# Altium project 1000BASET1_MEDIA_CONVERTER.PrjPcb
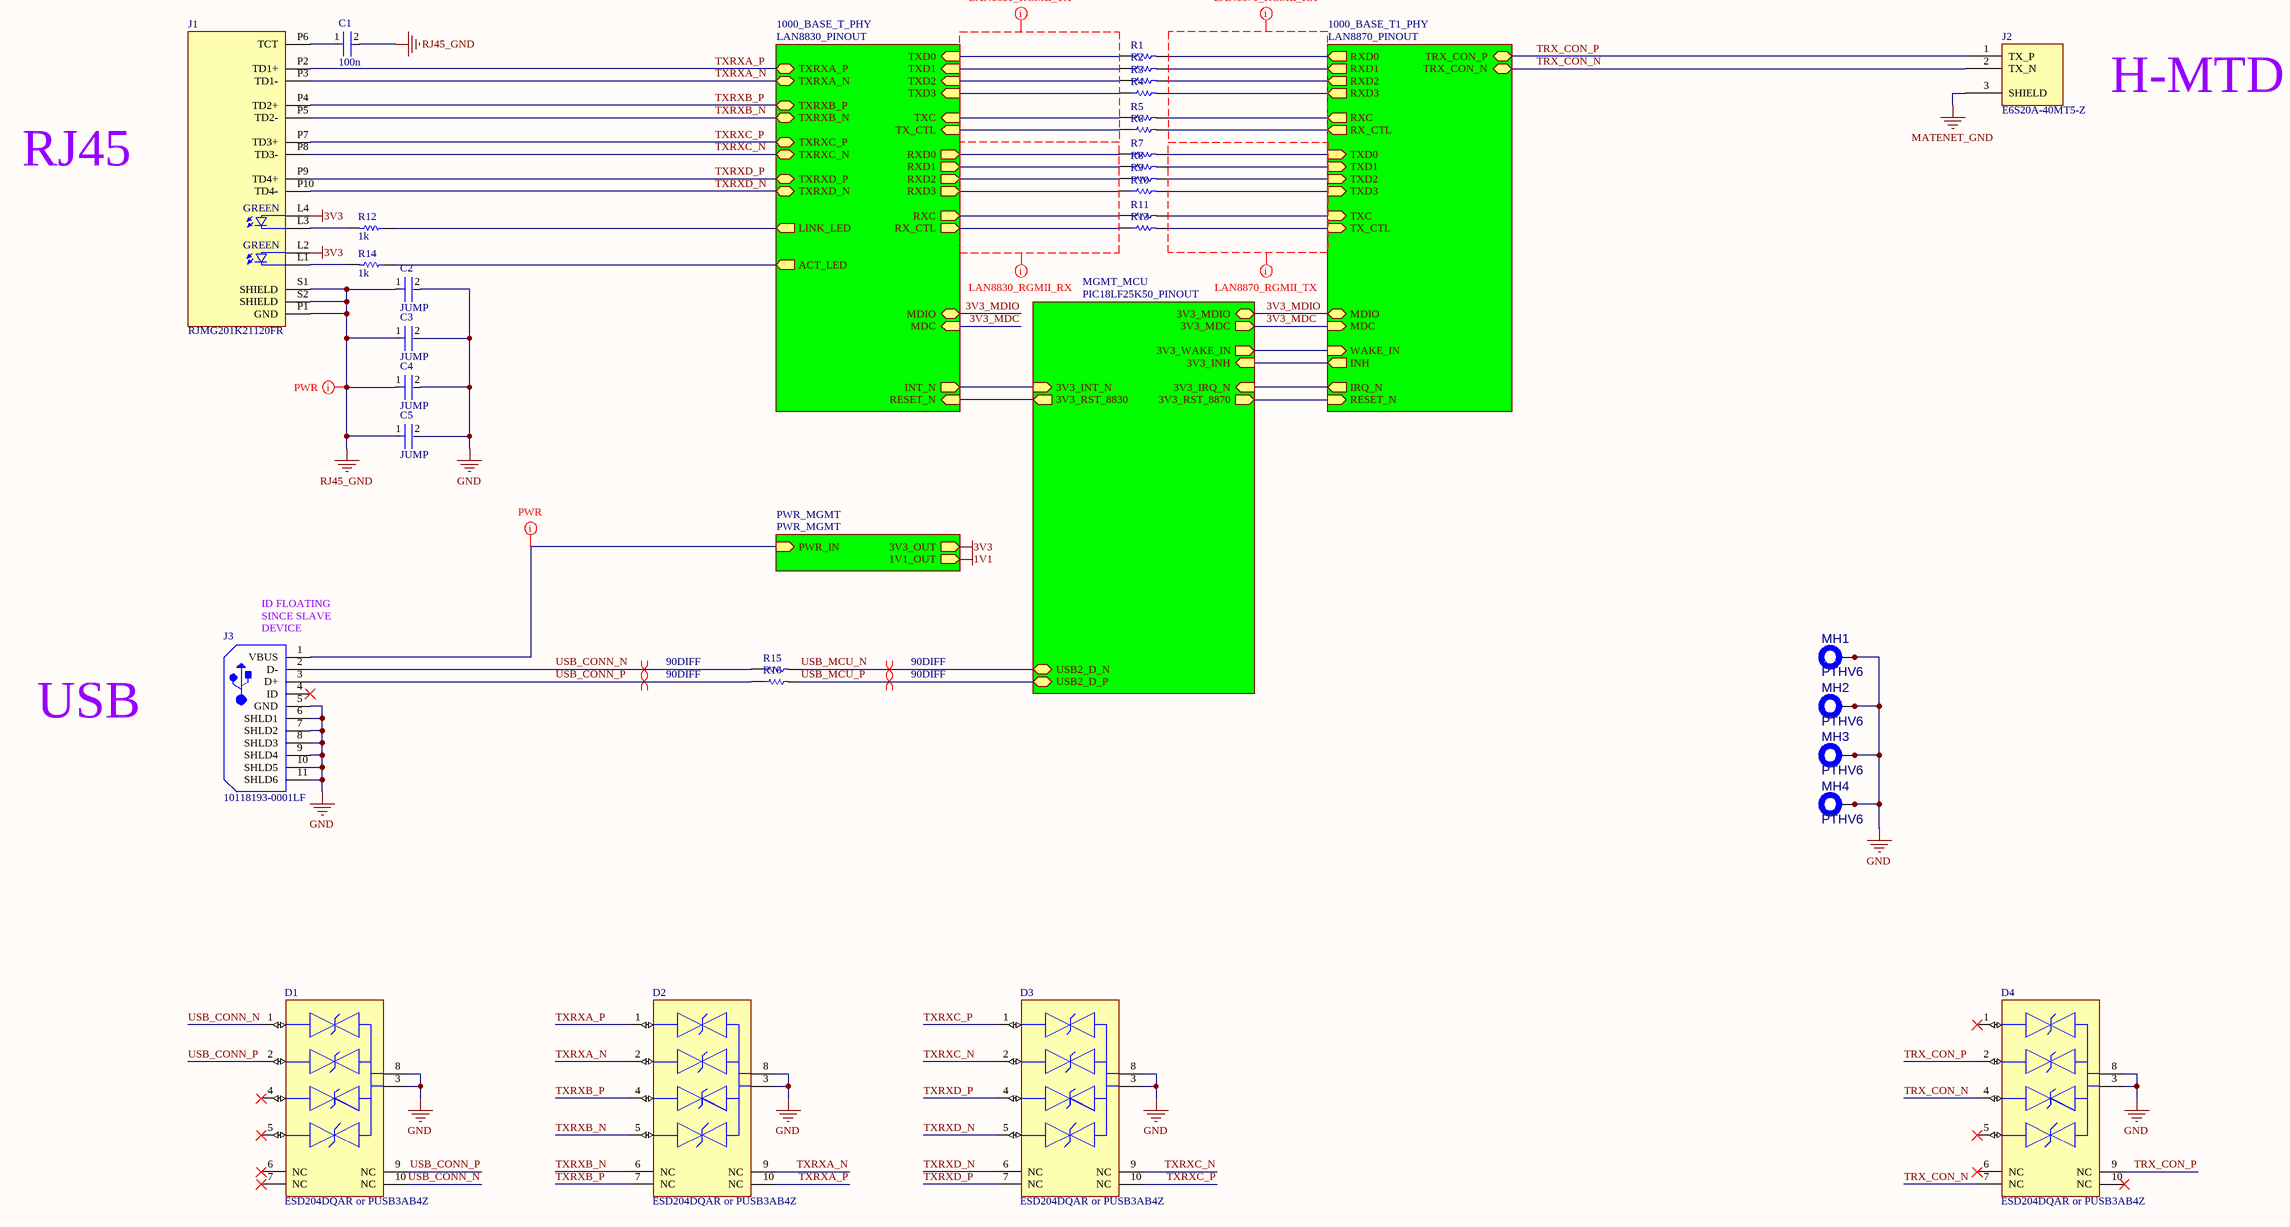
[diagram p0: 1000BASET1_MEDIA_CONVERTER.SchDoc]
5 sheets, 186 parts. Net scope: hierarchical (ports join the sheet entries above them; power ports are global).
Board file: 1000BASET1_MEDIA_CONVERTER.PcbDoc
Sheets:
  1000BASET1_MEDIA_CONVERTER.SchDoc
    1000_BASE_T_PHY = LAN8830_PINOUT.SchDoc
    1000_BASE_T1_PHY = LAN8870_PINOUT.SchDoc
    MGMT_MCU = PIC18LF25K50_PINOUT.SchDoc
    PWR_MGMT = PWR_MGMT.SchDoc

## Sheet 1000BASET1_MEDIA_CONVERTER.SchDoc
size C; SheetNumber: 1; SheetTotal: 5

### Parts
C1  100n  [FP-0402-L_1_0_0_05-W_0_5-IPC_A]
C2  JUMP  [FP-0402-L_1_0_0_05-W_0_5-IPC_A]
C3  JUMP  [FP-0402-L_1_0_0_05-W_0_5-IPC_A]
C4  JUMP  [FP-0402-L_1_0_0_05-W_0_5-IPC_A]
C5  JUMP  [FP-0402-L_1_0_0_05-W_0_5-IPC_A]
D1  ESD204DQAR or PUSB3AB4Z  [FP-DQA0010A-MFG]
D2  ESD204DQAR or PUSB3AB4Z  [FP-DQA0010A-MFG]
D3  ESD204DQAR or PUSB3AB4Z  [FP-DQA0010A-MFG]
D4  ESD204DQAR or PUSB3AB4Z  [FP-DQA0010A-MFG]
J1  RJMG201K21120FR  [RJMG201K21120FR-Footprint-1]
J2  E6S20A-40MT5-Z  [E6S20A-40MT5-Z-Footprint-1]
J3  10118193-0001LF  [FCI-10118193-0001LF-5_V]
MH1  PTHV6  [PTHV6 M2]  (net tie, no BOM)
MH2  PTHV6  [PTHV6 M2]  (net tie, no BOM)
MH3  PTHV6  [PTHV6 M2]  (net tie, no BOM)
MH4  PTHV6  [PTHV6 M2]  (net tie, no BOM)
R1  0402 JUMPER  [RESC1005X40X25ML05T05]  (value not drawn)
R2  0402 JUMPER  [RESC1005X40X25ML05T05]  (value not drawn)
R3  0402 JUMPER  [RESC1005X40X25ML05T05]  (value not drawn)
R4  0402 JUMPER  [RESC1005X40X25ML05T05]  (value not drawn)
R5  0402 JUMPER  [RESC1005X40X25ML05T05]  (value not drawn)
R6  0402 JUMPER  [RESC1005X40X25ML05T05]  (value not drawn)
R7  0402 JUMPER  [RESC1005X40X25ML05T05]  (value not drawn)
R8  0402 JUMPER  [RESC1005X40X25ML05T05]  (value not drawn)
R9  0402 JUMPER  [RESC1005X40X25ML05T05]  (value not drawn)
R10  0402 JUMPER  [RESC1005X40X25ML05T05]  (value not drawn)
R11  0402 JUMPER  [RESC1005X40X25ML05T05]  (value not drawn)
R12  1k  [R0603B]
R13  0402 JUMPER  [RESC1005X40X25ML05T05]  (value not drawn)
R14  1k  [R0603B]
R15  0402 JUMPER  [RESC1005X40X25ML05T05]  (value not drawn)
R16  0402 JUMPER  [RESC1005X40X25ML05T05]  (value not drawn)

### Sub-sheets
1000_BASE_T1_PHY = LAN8870_PINOUT: RXD0 (out), RXD1 (out), RXD2 (out), RXD3 (out), RXC (out), RX_CTL (out), TXD0 (in), TXD1 (in), TXD2 (in), TXD3 (in), TXC (in), TX_CTL (in), TRX_CON_P (bidir), TRX_CON_N (bidir), MDIO (bidir), MDC (in), IRQ_N (out), RESET_N (in), WAKE_IN (in), INH (out)
1000_BASE_T_PHY = LAN8830_PINOUT: TXD0 (in), TXD1 (in), TXD2 (in), TXD3 (in), TXC (in), TX_CTL (in), RXD0 (out), RXD1 (out), RXD2 (out), RXD3 (out), RXC (out), RX_CTL (out), TXRXA_P (bidir), TXRXA_N (bidir), TXRXB_P (bidir), TXRXB_N (bidir), TXRXC_P (bidir), TXRXC_N (bidir), TXRXD_P (bidir), TXRXD_N (bidir), ACT_LED (out), LINK_LED (out), MDIO (bidir), MDC (in), INT_N (out), RESET_N (in)
MGMT_MCU = PIC18LF25K50_PINOUT: 3V3_INH (in), 3V3_WAKE_IN (out), 3V3_RST_8870 (out), 3V3_IRQ_N (in), 3V3_RST_8830 (out), 3V3_INT_N (in), USB2_D_N (bidir), USB2_D_P (bidir), 3V3_MDC (out), 3V3_MDIO (bidir)
PWR_MGMT = PWR_MGMT: PWR_IN (in), 1V1_OUT (out), 3V3_OUT (out)

### Nets
3V3: J1.L2 J1.L4 ; sheet PWR_MGMT/3V3_OUT
GND: C2.2 C3.2 C4.2 C5.2 D1.3(GND) D1.8(GND) D2.3(GND) D2.8(GND) D3.3(GND) D3.8(GND) D4.3(GND) D4.8(GND) J3.5(GND) J3.6(SHLD1) J3.7(SHLD2) J3.8(SHLD3) J3.9(SHLD4) J3.10(SHLD5) J3.11(SHLD6) MH1.1(MH) MH1.2(V1) MH1.3(V2) MH1.4(V3) MH1.5(V4) MH1.6(V5) MH1.7(V6) MH2.1(MH) MH2.2(V1) MH2.3(V2) MH2.4(V3) MH2.5(V4) MH2.6(V5) MH2.7(V6) MH3.1(MH) MH3.2(V1) MH3.3(V2) MH3.4(V3) MH3.5(V4) MH3.6(V5) MH3.7(V6) MH4.1(MH) MH4.2(V1) MH4.3(V2) MH4.4(V3) MH4.5(V4) MH4.6(V5) MH4.7(V6)
MATENET_GND: J2.3(SHIELD)
RJ45_GND: C1.2 C2.1 C3.1 C4.1 C5.1 J1.P1(GND) J1.S1(SHIELD) J1.S2(SHIELD)
3V3_INH: sheet 1000_BASE_T1_PHY/INH, sheet MGMT_MCU/3V3_INH
3V3_INT_N: sheet 1000_BASE_T_PHY/INT_N, sheet MGMT_MCU/3V3_INT_N
3V3_IRQ_N: sheet 1000_BASE_T1_PHY/IRQ_N, sheet MGMT_MCU/3V3_IRQ_N
3V3_MDC: sheet 1000_BASE_T_PHY/MDC, sheet 1000_BASE_T1_PHY/MDC, sheet MGMT_MCU/3V3_MDC
3V3_MDIO: sheet 1000_BASE_T_PHY/MDIO, sheet 1000_BASE_T1_PHY/MDIO, sheet MGMT_MCU/3V3_MDIO
3V3_RST_8830: sheet 1000_BASE_T_PHY/RESET_N, sheet MGMT_MCU/3V3_RST_8830
3V3_RST_8870: sheet 1000_BASE_T1_PHY/RESET_N, sheet MGMT_MCU/3V3_RST_8870
3V3_WAKE_IN: sheet 1000_BASE_T1_PHY/WAKE_IN, sheet MGMT_MCU/3V3_WAKE_IN
LAN8830_CLK125_EN: R13.1 ; sheet 1000_BASE_T_PHY/RX_CTL
LAN8830_MODE0: R7.1 ; sheet 1000_BASE_T_PHY/RXD0
LAN8830_MODE1: R8.1 ; sheet 1000_BASE_T_PHY/RXD1
LAN8830_MODE2: R9.1 ; sheet 1000_BASE_T_PHY/RXD2
LAN8830_MODE3: R10.1 ; sheet 1000_BASE_T_PHY/RXD3
LAN8830_MODE4: R11.1 ; sheet 1000_BASE_T_PHY/RXC
LAN8830_PHYAD0: R14.1 ; sheet 1000_BASE_T_PHY/ACT_LED
LAN8830_PHYAD1: R12.1 ; sheet 1000_BASE_T_PHY/LINK_LED
LAN8870_RXCTL: R6.2 ; sheet 1000_BASE_T1_PHY/RX_CTL
LAN8870_RXD0: R1.2 ; sheet 1000_BASE_T1_PHY/RXD0
LAN8870_RXD1: R2.2 ; sheet 1000_BASE_T1_PHY/RXD1
LAN8870_RXD2: R3.2 ; sheet 1000_BASE_T1_PHY/RXD2
LAN8870_RXD3: R4.2 ; sheet 1000_BASE_T1_PHY/RXD3
TRX_CON_N: D4.4(IO3) D4.7(NC) J2.2(TX_N) ; sheet 1000_BASE_T1_PHY/TRX_CON_N
TRX_CON_P: D4.2(IO2) D4.9(NC) J2.1(TX_P) ; sheet 1000_BASE_T1_PHY/TRX_CON_P
TXRXA_N: D2.2(IO2) D2.9(NC) J1.P3(TD1-) ; sheet 1000_BASE_T_PHY/TXRXA_N  [project net LAN8830_TXRXA_N]
TXRXA_P: D2.1(IO1) D2.10(NC) J1.P2(TD1+) ; sheet 1000_BASE_T_PHY/TXRXA_P  [project net LAN8830_TXRXA_P]
TXRXB_N: D2.5(IO4) D2.6(NC) J1.P5(TD2-) ; sheet 1000_BASE_T_PHY/TXRXB_N  [project net LAN8830_TXRXB_N]
TXRXB_P: D2.4(IO3) D2.7(NC) J1.P4(TD2+) ; sheet 1000_BASE_T_PHY/TXRXB_P  [project net LAN8830_TXRXB_P]
TXRXC_N: D3.2(IO2) D3.9(NC) J1.P8(TD3-) ; sheet 1000_BASE_T_PHY/TXRXC_N  [project net LAN8830_TXRXC_N]
TXRXC_P: D3.1(IO1) D3.10(NC) J1.P7(TD3+) ; sheet 1000_BASE_T_PHY/TXRXC_P  [project net LAN8830_TXRXC_P]
TXRXD_N: D3.5(IO4) D3.6(NC) J1.P10(TD4-) ; sheet 1000_BASE_T_PHY/TXRXD_N  [project net LAN8830_TXRXD_N]
TXRXD_P: D3.4(IO3) D3.7(NC) J1.P9(TD4+) ; sheet 1000_BASE_T_PHY/TXRXD_P  [project net LAN8830_TXRXD_P]
USB_CONN_N: D1.1(IO1) D1.10(NC) J3.2(D-) R15.1
USB_CONN_P: D1.2(IO2) D1.9(NC) J3.3(D+) R16.1
USB_MCU_N: R15.2 ; sheet MGMT_MCU/USB2_D_N
USB_MCU_P: R16.2 ; sheet MGMT_MCU/USB2_D_P
NetC1_1: C1.1 J1.P6(TCT)
NetF1_1: J3.1(VBUS) ; sheet PWR_MGMT/PWR_IN
NetJ1_L1: J1.L1 R14.2
NetJ1_L3: J1.L3 R12.2
NetR1_1: R1.1 ; sheet 1000_BASE_T_PHY/TXD0
NetR2_1: R2.1 ; sheet 1000_BASE_T_PHY/TXD1
NetR3_1: R3.1 ; sheet 1000_BASE_T_PHY/TXD2
NetR4_1: R4.1 ; sheet 1000_BASE_T_PHY/TXD3
NetR5_1: R5.1 ; sheet 1000_BASE_T_PHY/TXC
NetR5_2: R5.2 ; sheet 1000_BASE_T1_PHY/RXC
NetR6_1: R6.1 ; sheet 1000_BASE_T_PHY/TX_CTL
NetR7_2: R7.2 ; sheet 1000_BASE_T1_PHY/TXD0
NetR8_2: R8.2 ; sheet 1000_BASE_T1_PHY/TXD1
NetR9_2: R9.2 ; sheet 1000_BASE_T1_PHY/TXD2
NetR10_2: R10.2 ; sheet 1000_BASE_T1_PHY/TXD3
NetR11_2: R11.2 ; sheet 1000_BASE_T1_PHY/TXC
NetR13_2: R13.2 ; sheet 1000_BASE_T1_PHY/TX_CTL

Not connected (* = marked no-connect by the designer): D1 4(IO3)* 5(IO4)* 6(NC)* 7(NC)*; D4 1(IO1)* 5(IO4)* 6(NC)* 10(NC)*; J3 4(ID)*

### Layout directives
differential pair; differential pair class 90DIFF: USB_CONN_N, USB_CONN_P, USB_MCU_N, USB_MCU_P
net class LAN8830_RGMII_TX: (no net found under the mark)
net class LAN8870_RGMII_RX: (no net found under the mark)
net class LAN8870_RGMII_TX: (no net found under the mark)
net class LAN8830_RGMII_RX: (no net found under the mark)
net class PWR: NetF1_1, RJ45_GND

### Notes on the sheet
- H-MTD
- RJ45
- (near J3) ID FLOATING SINCE SLAVE DEVICE
- USB
- (in symbol CMP-002-00090-1) GREEN

### Library data of the parts
C1-C5 = CMP-001-00058-1: LARGE PADS, 0402 CAP, CHANGE COMMENT TO MATCH REAL P/N; Capacitor Type: Ceramic; Min Operating Temperature: -55°C; Mounting Technology: Surface Mount; Pins: 2; Case/Package: 0402; RoHS Compliant: Yes; Max Operating Temperature: 85°C
D1-D4 = CMP-04989-000002-1: 4-CHANNEL LOW-CAPACITANCE SURGE; Manufacturer: Texas Instruments; Value: 0.55pF; Reverse Standoff Voltage: 3.6V; Standoff Height: 0mm; Breakdown Voltage: 5.5V; Peak Pulse Current: 5.5A; Clamping Voltage: 11.5V; Direction: Bidirectional; Peak Pulse Power: 50W; Number Of Channels: 4; Ambient Temperature Range High: +125°C; ComponentLink2Description: Datasheet; Height: 0.55mm; Lead Free: Yes; Device Class L3: unset; Temperature Range High: +125°C; Temperature Range Low: -40°C; Package: DQA0010A; Temperature: -40°C to +125°C; Capacitance: 0.55pF; RoHS: TRUE; Mouser Description: 4-Channel Low-Capacitance Surge and ESD Protection Diode 10-USON -40 to 125; Category: Diode; Device Class L1: Circuit Protection; Octopart: https://octopart.com/esd204dqar-texas+instruments-89917476; Device Class L2: TVS Diodes; Ambient Temperature Range Low: -40°C; Manufacturer Part Number: ESD204DQAR; ComponentLink2URL: http://www.ti.com/lit/ds/symlink/esd204.pdf; Automotive: No; Digikey Description: 4-CHANNEL LOW-CAPACITANCE SURGE
J1 = CMP-002-00090-1: Connector RJ45 Receptacle 8 Position Solder Straight Through Hole 1 Port Tray; Pins: 8; Max Operating Temperature: 70°C; Min Operating Temperature: 0°C
J2 = CMP-002-00103-1: RF Connector, 2 Contact(s), Male, Panel Mount, Board And Panel Mount, Solder Terminal, Plug; Pins: 2; Min Operating Temperature: -40°C; Max Operating Temperature: 105°C
J3 = CMP-2000-05119-1: Micro USB B Type Receptacle, -55 to 85 degC, 5-Pin SMD, RoHS, Tape and Reel; Manufacturer: FCI; Insulation Resistance: 1000MOhms; Gender: Female; Current Rating: 1.8A; Number of Contacts: 5Contact; Connector Type: MicroUSBTypeBreceptacle; Mounting Angle: Right; Datasheet Version: Rev. C, 05/2015; Packaging: Reel; Product Category: USBConnectors; Standard: USB2.0; Factory Pack Quantity: 1200; Operating Temperature Range: -55Cto+85C; Termination Style: SMD/SMT; Datasheet URL: http://datasheet.octopart.com/10118193-0001LF-FCI-datasheet-55953155.pdf; Contact Material: CopperAlloy; RoHS: Details; Contact Plating: Gold; Flammability Rating: UL94V-0; Manufacturer URL: http://www.fci.com/; Brand: FCI; Product: MicroUSBTypeBConnectors; Color: Black
MH1-MH4 = CMP-00028-00001-13: Plated mounting hole with 6 peripheral vias. This is a generic symbol that groups all relevant footprints.
R1-R11 R13 R15 R16 = CMP-009-00118-2: READ THE NAME; Pins: 2; Component Type: Standard; Design Item ID: CMP-009-00206-2; Source: 0402jump.SchLib
R12 R14 = CMP-009-00002-14: Resistor; Value: 1k

## Sheet LAN8830_PINOUT.SchDoc
size C; SheetNumber: 2; SheetTotal: 5
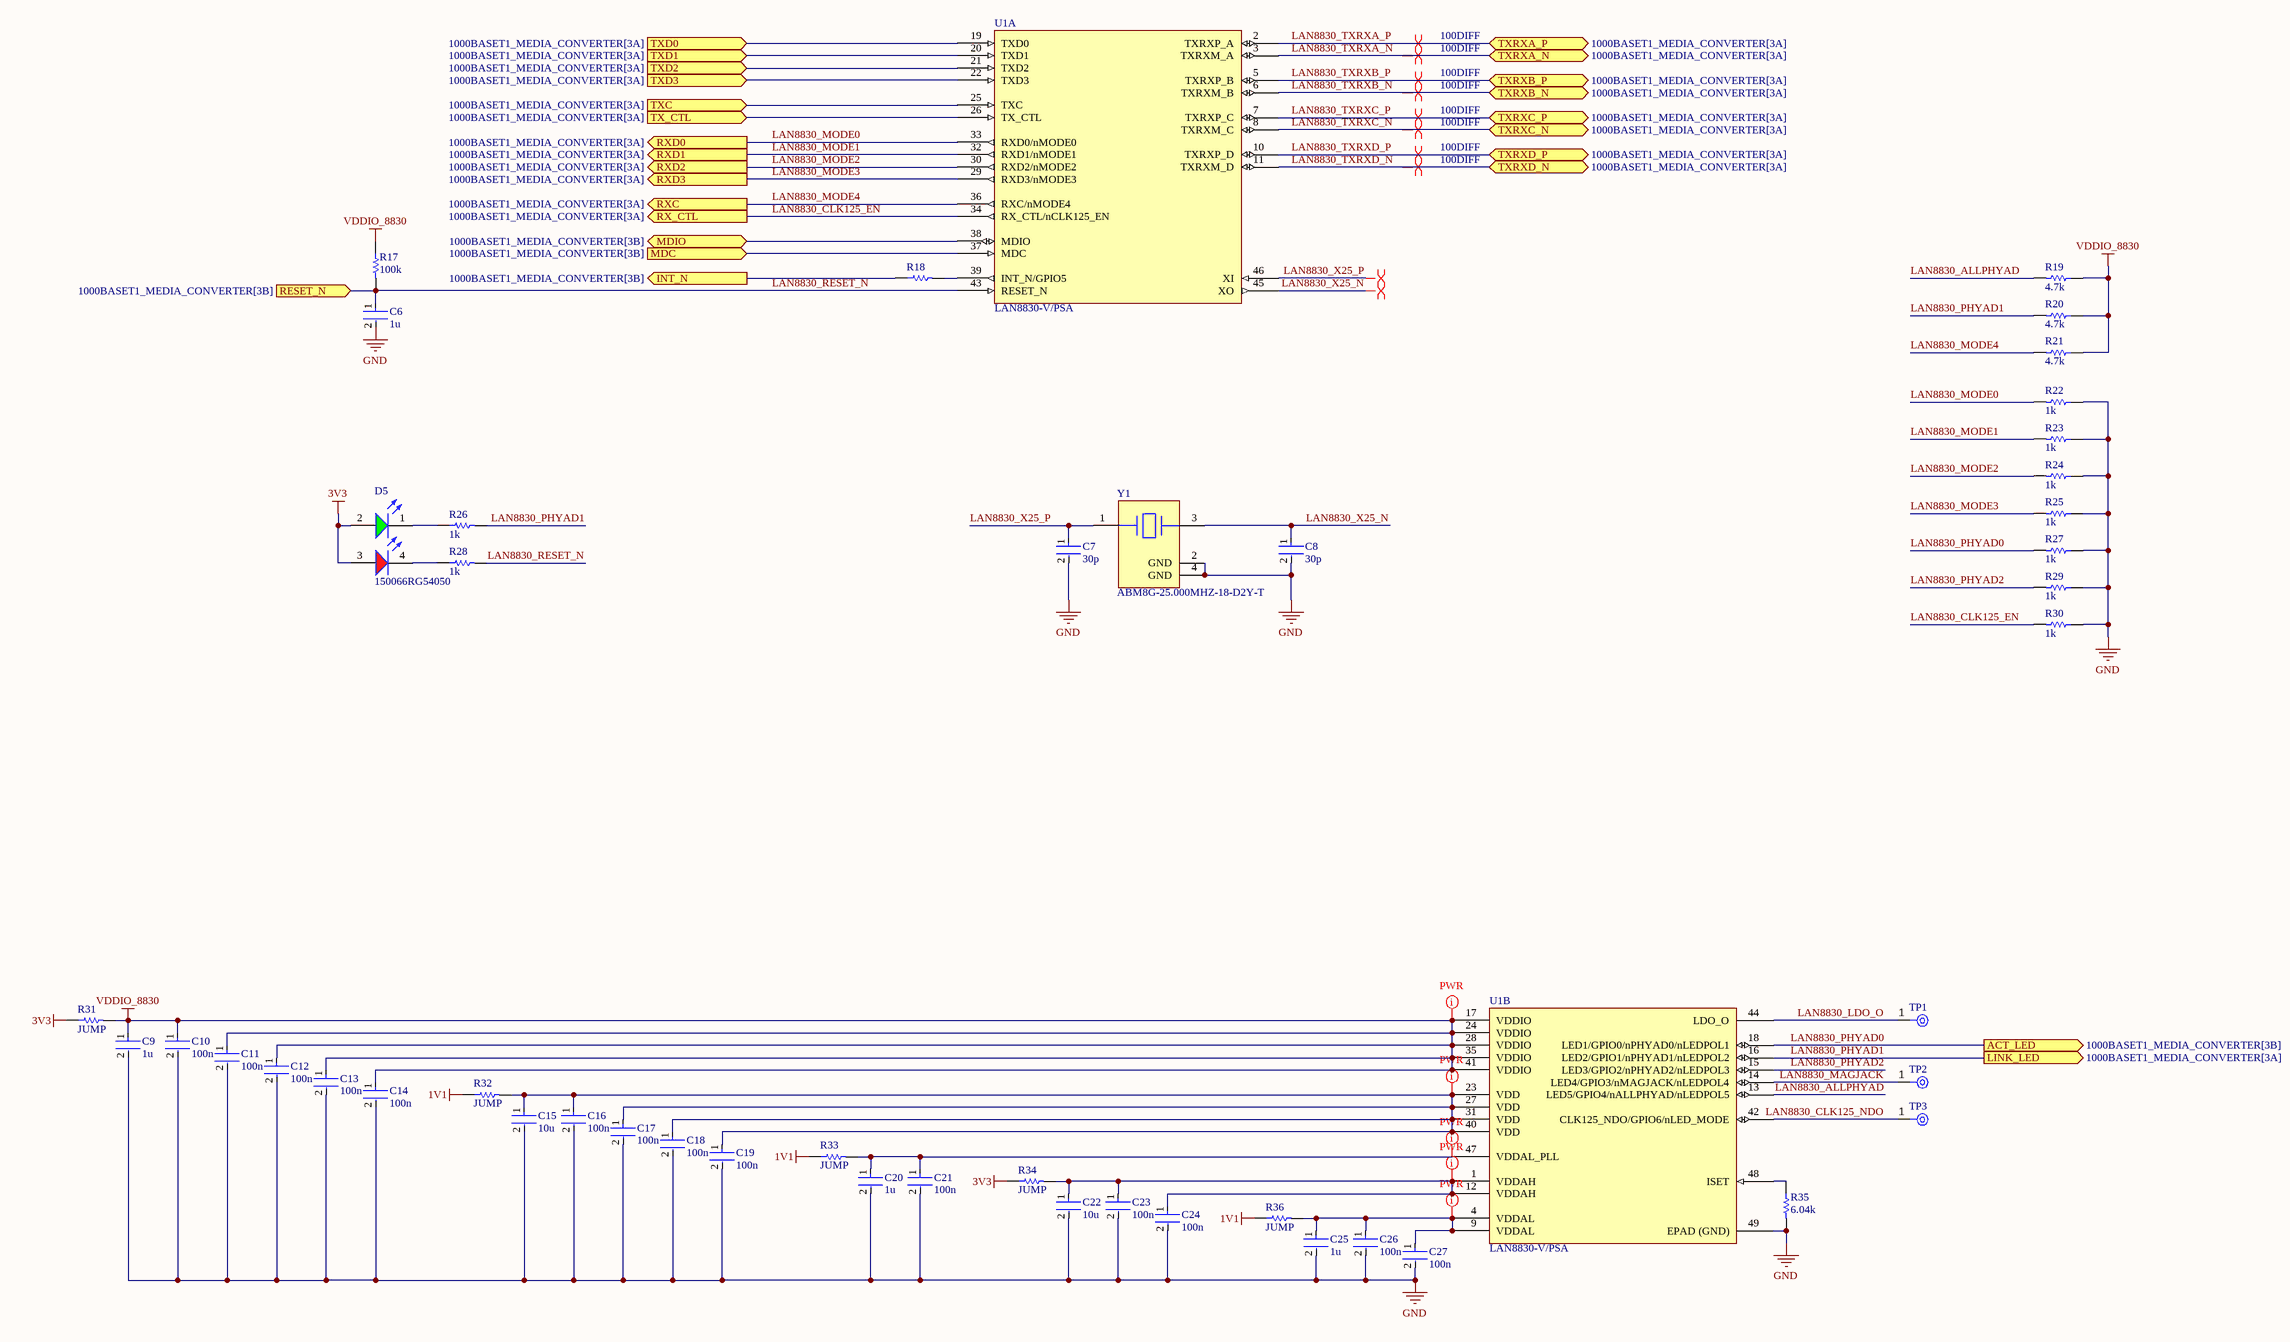
[diagram p1: LAN8830_PINOUT.SchDoc]

### Parts
C6  1u  [FP-0402-L_1_0_0_05-W_0_5-IPC_A]
C7  30p  [FP-0402-L_1_0_0_05-W_0_5-IPC_A]
C8  30p  [FP-0402-L_1_0_0_05-W_0_5-IPC_A]
C9  1u  [FP-0402-L_1_0_0_05-W_0_5-IPC_A]
C10  100n  [FP-0402-L_1_0_0_05-W_0_5-IPC_A]
C11  100n  [FP-0402-L_1_0_0_05-W_0_5-IPC_A]
C12  100n  [FP-0402-L_1_0_0_05-W_0_5-IPC_A]
C13  100n  [FP-0402-L_1_0_0_05-W_0_5-IPC_A]
C14  100n  [FP-0402-L_1_0_0_05-W_0_5-IPC_A]
C15  10u  [FP-0402-L_1_0_0_05-W_0_5-IPC_A]
C16  100n  [FP-0402-L_1_0_0_05-W_0_5-IPC_A]
C17  100n  [FP-0402-L_1_0_0_05-W_0_5-IPC_A]
C18  100n  [FP-0402-L_1_0_0_05-W_0_5-IPC_A]
C19  100n  [FP-0402-L_1_0_0_05-W_0_5-IPC_A]
C20  1u  [FP-0402-L_1_0_0_05-W_0_5-IPC_A]
C21  100n  [FP-0402-L_1_0_0_05-W_0_5-IPC_A]
C22  10u  [FP-0402-L_1_0_0_05-W_0_5-IPC_A]
C23  100n  [FP-0402-L_1_0_0_05-W_0_5-IPC_A]
C24  100n  [FP-0402-L_1_0_0_05-W_0_5-IPC_A]
C25  1u  [FP-0402-L_1_0_0_05-W_0_5-IPC_A]
C26  100n  [FP-0402-L_1_0_0_05-W_0_5-IPC_A]
C27  100n  [FP-0402-L_1_0_0_05-W_0_5-IPC_A]
D5  150066RG54050  [WL-SBCD_0606]
R17  100k  [R0603B]
R18  0402 JUMPER  [RESC1005X40X25ML05T05]  (value not drawn)
R19  4.7k  [R0603B]
R20  4.7k  [R0603B]
R21  4.7k  [R0603B]
R22  1k  [R0603B]
R23  1k  [R0603B]
R24  1k  [R0603B]
R25  1k  [R0603B]
R26  1k  [R0603B]
R27  1k  [R0603B]
R28  1k  [R0603B]
R29  1k  [R0603B]
R30  1k  [R0603B]
R31  JUMP  [R0603B]
R32  JUMP  [R0603B]
R33  JUMP  [R0603B]
R34  JUMP  [R0603B]
R35  6.04k  [R0603B]
R36  JUMP  [R0603B]
TP1  TPAD6R  [New footprint 1]  (value not drawn)  (no BOM)
TP2  TPAD6R  [New footprint 1]  (value not drawn)  (no BOM)
TP3  TPAD6R  [New footprint 1]  (value not drawn)  (no BOM)
U1  LAN8830-V/PSA  [QFN50P700X700X100_HS-49N]  (parts A,B of 2)
Y1  ABM8G-25.000MHZ-18-D2Y-T  [FP-ABM8G-MFG]

### Ports
ACT_LED (out, see 1000BASET1_MEDIA_CONVERTER[3B]), INT_N (out, see 1000BASET1_MEDIA_CONVERTER[3B]), LINK_LED (out, see 1000BASET1_MEDIA_CONVERTER[3A]), MDC (in, see 1000BASET1_MEDIA_CONVERTER[3B]), MDIO (bidir, see 1000BASET1_MEDIA_CONVERTER[3B]), RESET_N (in, see 1000BASET1_MEDIA_CONVERTER[3B]), RX_CTL (out, see 1000BASET1_MEDIA_CONVERTER[3A]), RXC (out, see 1000BASET1_MEDIA_CONVERTER[3A]), RXD0 (out, see 1000BASET1_MEDIA_CONVERTER[3A]), RXD1 (out, see 1000BASET1_MEDIA_CONVERTER[3A]), RXD2 (out, see 1000BASET1_MEDIA_CONVERTER[3A]), RXD3 (out, see 1000BASET1_MEDIA_CONVERTER[3A]), TX_CTL (in, see 1000BASET1_MEDIA_CONVERTER[3A]), TXC (in, see 1000BASET1_MEDIA_CONVERTER[3A]), TXD0 (in, see 1000BASET1_MEDIA_CONVERTER[3A]), TXD1 (in, see 1000BASET1_MEDIA_CONVERTER[3A]), TXD2 (in, see 1000BASET1_MEDIA_CONVERTER[3A]), TXD3 (in, see 1000BASET1_MEDIA_CONVERTER[3A]), TXRXA_N (bidir, see 1000BASET1_MEDIA_CONVERTER[3A]), TXRXA_P (bidir, see 1000BASET1_MEDIA_CONVERTER[3A]), TXRXB_N (bidir, see 1000BASET1_MEDIA_CONVERTER[3A]), TXRXB_P (bidir, see 1000BASET1_MEDIA_CONVERTER[3A]), TXRXC_N (bidir, see 1000BASET1_MEDIA_CONVERTER[3A]), TXRXC_P (bidir, see 1000BASET1_MEDIA_CONVERTER[3A]), TXRXD_N (bidir, see 1000BASET1_MEDIA_CONVERTER[3A]), TXRXD_P (bidir, see 1000BASET1_MEDIA_CONVERTER[3A])

### Nets
1V1: R32.1 R33.1 R36.1
3V3: D5.2(A) D5.3(A) R31.1 R34.1
GND: C6.2 C7.2 C8.2 C9.2 C10.2 C11.2 C12.2 C13.2 C14.2 C15.2 C16.2 C17.2 C18.2 C19.2 C20.2 C21.2 C22.2 C23.2 C24.2 C25.2 C26.2 C27.2 R22.1 R23.1 R24.1 R25.1 R27.1 R29.1 R30.1 R35.2 U1.49(EPAD_(GND)) Y1.2(GND) Y1.4(GND)
VDDIO_8830: C9.1 C10.1 C11.1 C12.1 C13.1 C14.1 R17.1 R19.1 R20.1 R21.1 R31.2 U1.17(VDDIO) U1.24(VDDIO) U1.28(VDDIO) U1.35(VDDIO) U1.41(VDDIO)
3V3_INT_N: R18.1 ; port INT_N
3V3_MDC: U1.37(MDC) ; port MDC
3V3_MDIO: U1.38(MDIO) ; port MDIO
LAN8830_ALLPHYAD: R19.2 U1.13(LED5/GPIO4/nALLPHYAD/nLEDPOL5)
LAN8830_CLK125_EN: R30.2 U1.34(RX_CTL/nCLK125_EN) ; port RX_CTL
LAN8830_CLK125_NDO: TP3.1(TP) U1.42(CLK125_NDO/GPIO6/nLED_MODE)
LAN8830_LDO_O: TP1.1(TP) U1.44(LDO_O)
LAN8830_MAGJACK: TP2.1(TP) U1.14(LED4/GPIO3/nMAGJACK/nLEDPOL4)
LAN8830_MODE0: R22.2 U1.33(RXD0/nMODE0) ; port RXD0
LAN8830_MODE1: R23.2 U1.32(RXD1/nMODE1) ; port RXD1
LAN8830_MODE2: R24.2 U1.30(RXD2/nMODE2) ; port RXD2
LAN8830_MODE3: R25.2 U1.29(RXD3/nMODE3) ; port RXD3
LAN8830_MODE4: R21.2 U1.36(RXC/nMODE4) ; port RXC
LAN8830_PHYAD0: R27.2 U1.18(LED1/GPIO0/nPHYAD0/nLEDPOL1) ; port ACT_LED
LAN8830_PHYAD1: R20.2 R26.2 U1.16(LED2/GPIO1/nPHYAD1/nLEDPOL2) ; port LINK_LED
LAN8830_PHYAD2: R29.2 U1.15(LED3/GPIO2/nPHYAD2/nLEDPOL3)
LAN8830_RESET_N: C6.1 R17.2 R28.2 U1.43(RESET_N) ; port RESET_N  [project net 3V3_RST_8830]
LAN8830_TXRXA_N: U1.3(TXRXM_A) ; port TXRXA_N
LAN8830_TXRXA_P: U1.2(TXRXP_A) ; port TXRXA_P
LAN8830_TXRXB_N: U1.6(TXRXM_B) ; port TXRXB_N
LAN8830_TXRXB_P: U1.5(TXRXP_B) ; port TXRXB_P
LAN8830_TXRXC_N: U1.8(TXRXM_C) ; port TXRXC_N
LAN8830_TXRXC_P: U1.7(TXRXP_C) ; port TXRXC_P
LAN8830_TXRXD_N: U1.11(TXRXM_D) ; port TXRXD_N
LAN8830_TXRXD_P: U1.10(TXRXP_D) ; port TXRXD_P
LAN8830_X25_N: C8.1 U1.45(XO) Y1.3
LAN8830_X25_P: C7.1 U1.46(XI) Y1.1
NetC15_1: C15.1 C16.1 C17.1 C18.1 C19.1 R32.2 U1.23(VDD) U1.27(VDD) U1.31(VDD) U1.40(VDD)
NetC20_1: C20.1 C21.1 R33.2 U1.47(VDDAL_PLL)
NetC22_1: C22.1 C23.1 C24.1 R34.2 U1.1(VDDAH) U1.12(VDDAH)
NetC25_1: C25.1 C26.1 C27.1 R36.2 U1.4(VDDAL) U1.9(VDDAL)
NetD5_1: D5.1(K) R26.1
NetD5_4: D5.4(K) R28.1
NetR1_1: U1.19(TXD0) ; port TXD0
NetR2_1: U1.20(TXD1) ; port TXD1
NetR3_1: U1.21(TXD2) ; port TXD2
NetR4_1: U1.22(TXD3) ; port TXD3
NetR5_1: U1.25(TXC) ; port TXC
NetR6_1: U1.26(TX_CTL) ; port TX_CTL
NetR18_2: R18.2 U1.39(INT_N/GPIO5)
NetR35_1: R35.1 U1.48(ISET)

### Layout directives
differential pair; differential pair class 100DIFF: LAN8830_TXRXA_N, LAN8830_TXRXA_P, LAN8830_TXRXB_N, LAN8830_TXRXB_P, LAN8830_TXRXC_N, LAN8830_TXRXC_P, LAN8830_TXRXD_N, LAN8830_TXRXD_P
differential pair: LAN8830_X25_N, LAN8830_X25_P
net class PWR: NetC15_1, NetC20_1, NetC22_1, NetC25_1, VDDIO_8830

### Library data of the parts
C6-C27 = CMP-001-00058-1: as C1 on sheet 1000BASET1_MEDIA_CONVERTER; Min Operating Temperature: -55°C; Mounting Technology: Surface Mount; Pins: 2; Case/Package: 0402; RoHS Compliant: Yes; Max Operating Temperature: 85°C
D5 = CMP-004-00040-2: Led, Red/Grn, 180Mcd/230Mcd, 624Nm/525Nm Rohs Compliant: Yes; Source: rgled.SchLib; Component Type: Standard; Design Item ID: CMP-004-00034-2; Pins: 4
R17 R19-R30 R35 = CMP-009-00002-14: Resistor
  R17: Value: 100k
  R19-R21: Value: 4.7k
  R22-R30: Value: 1k
  R35: Value: 6.04k
R18 = CMP-009-00118-2: READ THE NAME; Pins: 2; Component Type: Standard; Design Item ID: CMP-009-00206-2; Source: 0402jump.SchLib
R31-R34 R36 = CMP-009-00002-14: Resistor; Value: 0
TP1-TP3 = CMP-00025-3: Test Point .6mm
U1 = CMP-015-00022-4: LAN8830 Series RGMII Interface Gigabit Ethernet Transceiver - VQFN-48; Case/Package: VQFN; Pins: 48
Y1 = CMP-2000-05733-3: Crystal 25MHz ±20ppm (Tol) ±30ppm (Stability) 18pF FUND 60Ω 4-Pin SMD T/R; Series Resistance: 60R; Length: 3.2mm; Depth: 2.5mm; Packaging: Tape and Reel; Min Operating Temperature: -40°C; Operating Frequency: 25 MHz; Lead Free: Lead Free; Number of Pins: 4; Frequency Tolerance: 20ppm; Radiation Hardening: No; Max Operating Temperature: 85°C; Termination: SMD/SMT; Frequency Stability: 30ppm; Frequency: 25MHz; Series: ABM8G; Mount: Surface Mount; Package Quantity: 1000; Height: 0.039inch; Width: 0.098inch; Case/Package: CSMD; ESR (Equivalent Series Resistance): 60R; Load Capacitance: 18pF; Tolerance: 20ppm

## Sheet LAN8870_PINOUT.SchDoc
size C; SheetNumber: 3; SheetTotal: 5
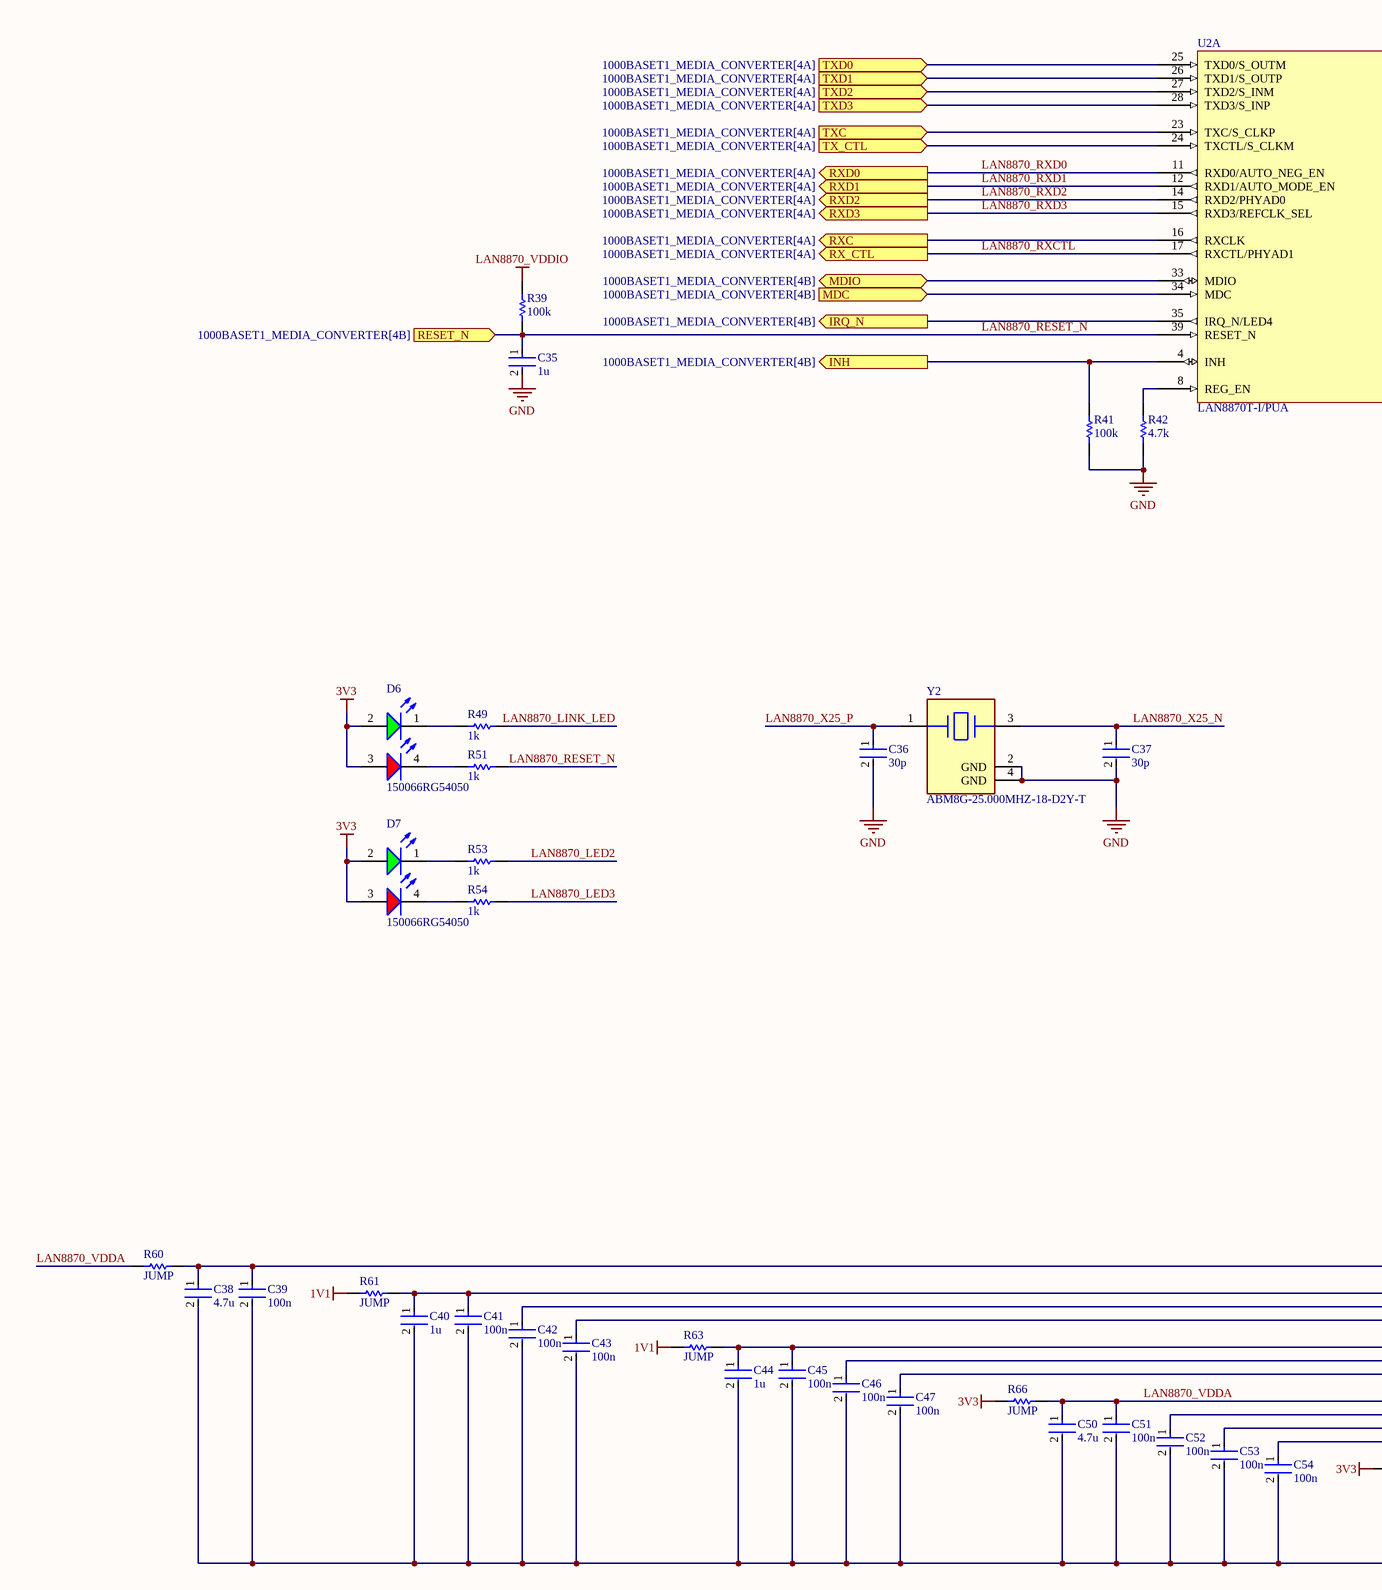
[diagram p2: LAN8870_PINOUT.SchDoc, left]
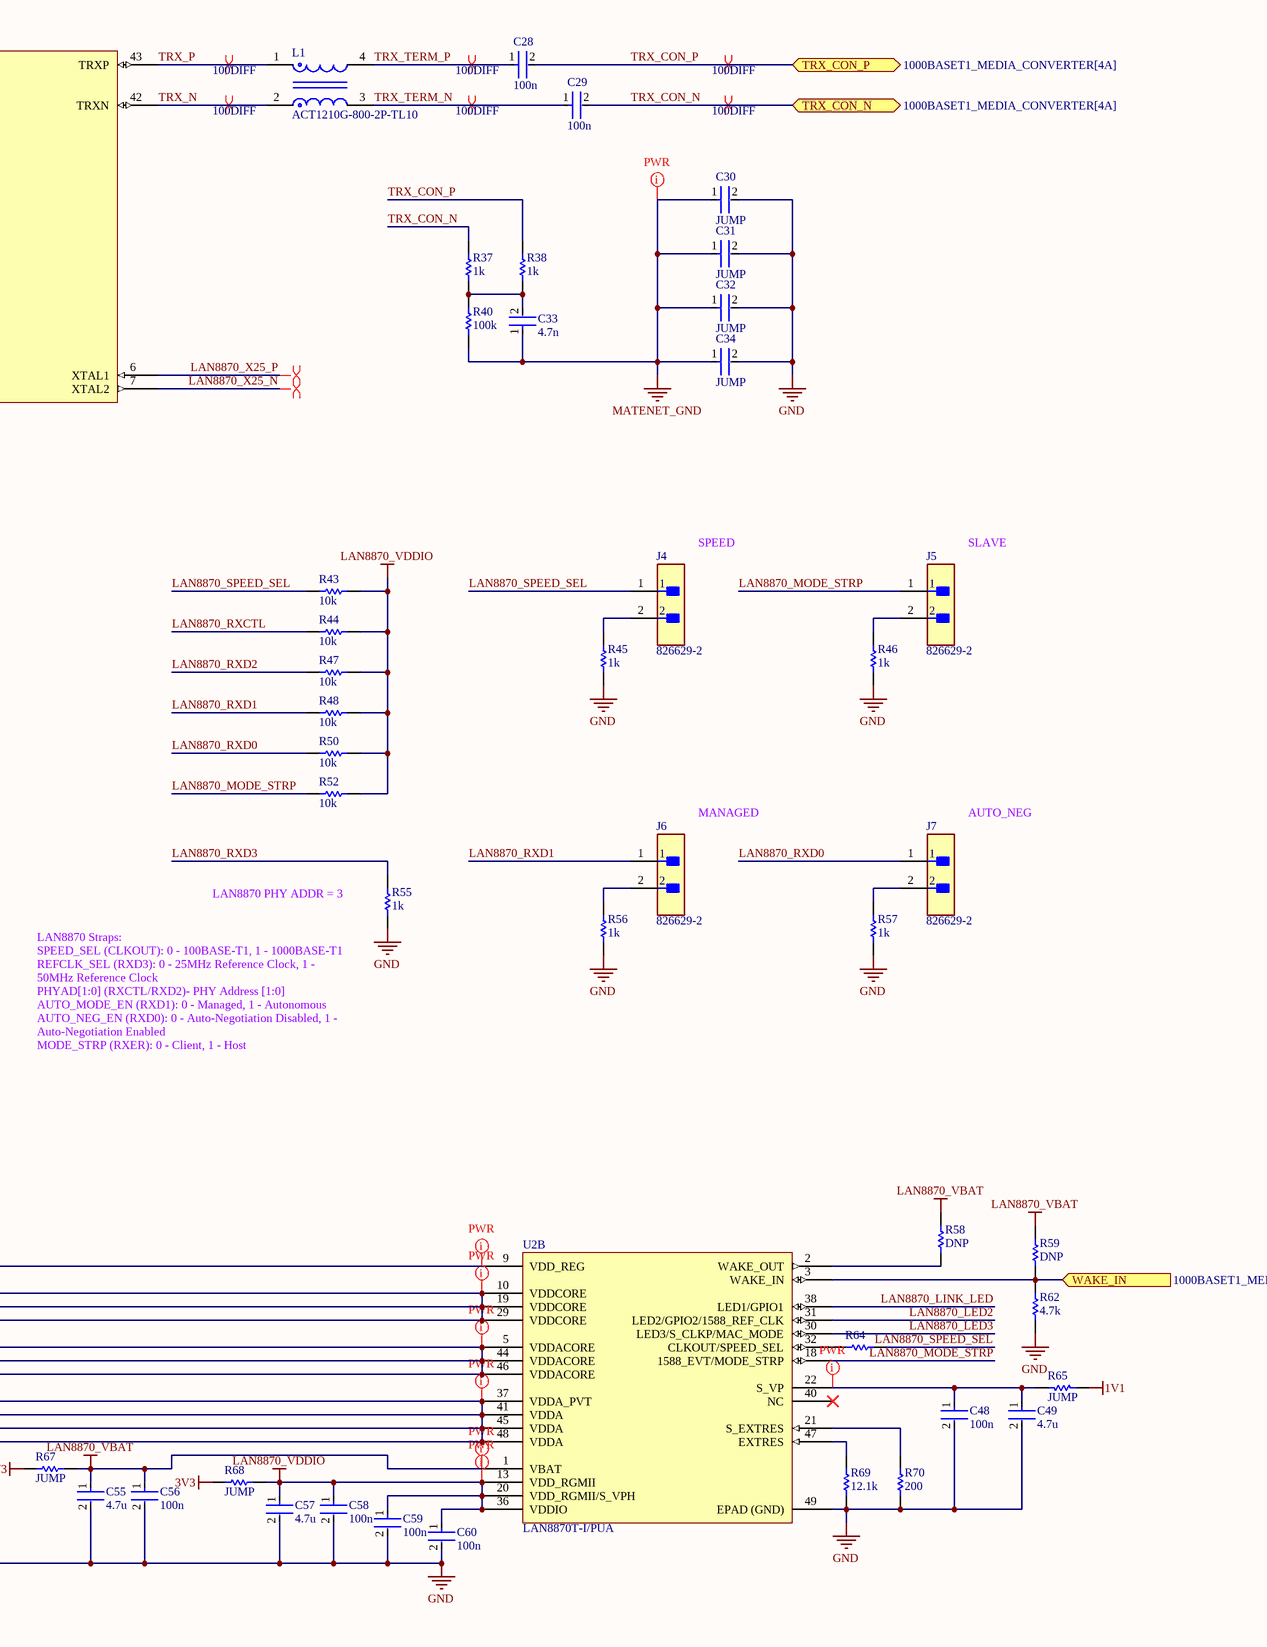
[diagram p3: LAN8870_PINOUT.SchDoc, right]

### Parts
C28  100n  [FP-0402-L_1_0_0_05-W_0_5-IPC_A]
C29  100n  [FP-0402-L_1_0_0_05-W_0_5-IPC_A]
C30  JUMP  [FP-0402-L_1_0_0_05-W_0_5-IPC_A]
C31  JUMP  [FP-0402-L_1_0_0_05-W_0_5-IPC_A]
C32  JUMP  [FP-0402-L_1_0_0_05-W_0_5-IPC_A]
C33  4.7n  [FP-0402-L_1_0_0_05-W_0_5-IPC_A]
C34  JUMP  [FP-0402-L_1_0_0_05-W_0_5-IPC_A]
C35  1u  [FP-0402-L_1_0_0_05-W_0_5-IPC_A]
C36  30p  [FP-0402-L_1_0_0_05-W_0_5-IPC_A]
C37  30p  [FP-0402-L_1_0_0_05-W_0_5-IPC_A]
C38  4.7u  [FP-0402-L_1_0_0_05-W_0_5-IPC_A]
C39  100n  [FP-0402-L_1_0_0_05-W_0_5-IPC_A]
C40  1u  [FP-0402-L_1_0_0_05-W_0_5-IPC_A]
C41  100n  [FP-0402-L_1_0_0_05-W_0_5-IPC_A]
C42  100n  [FP-0402-L_1_0_0_05-W_0_5-IPC_A]
C43  100n  [FP-0402-L_1_0_0_05-W_0_5-IPC_A]
C44  1u  [FP-0402-L_1_0_0_05-W_0_5-IPC_A]
C45  100n  [FP-0402-L_1_0_0_05-W_0_5-IPC_A]
C46  100n  [FP-0402-L_1_0_0_05-W_0_5-IPC_A]
C47  100n  [FP-0402-L_1_0_0_05-W_0_5-IPC_A]
C48  100n  [FP-0402-L_1_0_0_05-W_0_5-IPC_A]
C49  4.7u  [FP-0402-L_1_0_0_05-W_0_5-IPC_A]
C50  4.7u  [FP-0402-L_1_0_0_05-W_0_5-IPC_A]
C51  100n  [FP-0402-L_1_0_0_05-W_0_5-IPC_A]
C52  100n  [FP-0402-L_1_0_0_05-W_0_5-IPC_A]
C53  100n  [FP-0402-L_1_0_0_05-W_0_5-IPC_A]
C54  100n  [FP-0402-L_1_0_0_05-W_0_5-IPC_A]
C55  4.7u  [FP-0402-L_1_0_0_05-W_0_5-IPC_A]
C56  100n  [FP-0402-L_1_0_0_05-W_0_5-IPC_A]
C57  4.7u  [FP-0402-L_1_0_0_05-W_0_5-IPC_A]
C58  100n  [FP-0402-L_1_0_0_05-W_0_5-IPC_A]
C59  100n  [FP-0402-L_1_0_0_05-W_0_5-IPC_A]
C60  100n  [FP-0402-L_1_0_0_05-W_0_5-IPC_A]
D6  150066RG54050  [WL-SBCD_0606]
D7  150066RG54050  [WL-SBCD_0606]
J4  826629-2  [FP-826629-2-MFG]
J5  826629-2  [FP-826629-2-MFG]
J6  826629-2  [FP-826629-2-MFG]
J7  826629-2  [FP-826629-2-MFG]
L1  ACT1210G-800-2P-TL10  [FP-ACT1210G-800-2P-TL10-MFG]
R37  1k  [R0603B]
R38  1k  [R0603B]
R39  100k  [R0603B]
R40  100k  [R0603B]
R41  100k  [R0603B]
R42  4.7k  [R0603B]
R43  10k  [R0603B]
R44  10k  [R0603B]
R45  1k  [R0603B]
R46  1k  [R0603B]
R47  10k  [R0603B]
R48  10k  [R0603B]
R49  1k  [R0603B]
R50  10k  [R0603B]
R51  1k  [R0603B]
R52  10k  [R0603B]
R53  1k  [R0603B]
R54  1k  [R0603B]
R55  1k  [R0603B]
R56  1k  [R0603B]
R57  1k  [R0603B]
R58  DNP  [R0603B]
R59  DNP  [R0603B]
R60  JUMP  [R0603B]
R61  JUMP  [R0603B]
R62  4.7k  [R0603B]
R63  JUMP  [R0603B]
R64  0402 JUMPER  [RESC1005X40X25ML05T05]  (value not drawn)
R65  JUMP  [R0603B]
R66  JUMP  [R0603B]
R67  JUMP  [R0603B]
R68  JUMP  [R0603B]
R69  12.1k  [R0603B]
R70  200  [R0603B]
U2  LAN8870T-I/PUA  [QFN50P700X700X100_HS-49N]  (parts A,B of 2)
Y2  ABM8G-25.000MHZ-18-D2Y-T  [FP-ABM8G-MFG]

### Ports
INH (out, see 1000BASET1_MEDIA_CONVERTER[4B]), IRQ_N (out, see 1000BASET1_MEDIA_CONVERTER[4B]), MDC (in, see 1000BASET1_MEDIA_CONVERTER[4B]), MDIO (bidir, see 1000BASET1_MEDIA_CONVERTER[4B]), RESET_N (in, see 1000BASET1_MEDIA_CONVERTER[4B]), RX_CTL (out, see 1000BASET1_MEDIA_CONVERTER[4A]), RXC (out, see 1000BASET1_MEDIA_CONVERTER[4A]), RXD0 (out, see 1000BASET1_MEDIA_CONVERTER[4A]), RXD1 (out, see 1000BASET1_MEDIA_CONVERTER[4A]), RXD2 (out, see 1000BASET1_MEDIA_CONVERTER[4A]), RXD3 (out, see 1000BASET1_MEDIA_CONVERTER[4A]), TRX_CON_N (bidir, see 1000BASET1_MEDIA_CONVERTER[4A]), TRX_CON_P (bidir, see 1000BASET1_MEDIA_CONVERTER[4A]), TX_CTL (in, see 1000BASET1_MEDIA_CONVERTER[4A]), TXC (in, see 1000BASET1_MEDIA_CONVERTER[4A]), TXD0 (in, see 1000BASET1_MEDIA_CONVERTER[4A]), TXD1 (in, see 1000BASET1_MEDIA_CONVERTER[4A]), TXD2 (in, see 1000BASET1_MEDIA_CONVERTER[4A]), TXD3 (in, see 1000BASET1_MEDIA_CONVERTER[4A]), WAKE_IN (in, see 1000BASET1_MEDIA_CONVERTER[4B])

### Nets
1V1: R61.1 R63.1 R65.1
3V3: D6.2(A) D6.3(A) D7.2(A) D7.3(A) R66.1 R67.1 R68.1
GND: C30.2 C31.2 C32.2 C34.2 C35.2 C36.2 C37.2 C38.2 C39.2 C40.2 C41.2 C42.2 C43.2 C44.2 C45.2 C46.2 C47.2 C48.2 C49.2 C50.2 C51.2 C52.2 C53.2 C54.2 C55.2 C56.2 C57.2 C58.2 C59.2 C60.2 R41.2 R42.2 R45.1 R46.1 R55.1 R56.1 R57.1 R62.2 R69.2 R70.2 U2.49(EPAD_(GND)) Y2.2(GND) Y2.4(GND)
LAN8870_VBAT: C55.1 C56.1 R58.1 R59.1 R67.2 U2.1(VBAT)
LAN8870_VDDIO: C57.1 C58.1 C59.1 C60.1 R39.1 R43.2 R44.1 R47.2 R48.2 R50.2 R52.2 R68.2 U2.13(VDD_RGMII) U2.20(VDD_RGMII/S_VPH) U2.36(VDDIO)
MATENET_GND: C30.1 C31.1 C32.1 C33.1 C34.1 R40.2
3V3_INH: R41.1 U2.4(INH) ; port INH
3V3_IRQ_N: U2.35(IRQ_N/LED4) ; port IRQ_N
3V3_MDC: U2.34(MDC) ; port MDC
3V3_MDIO: U2.33(MDIO) ; port MDIO
3V3_WAKE_IN: R59.2 R62.1 U2.3(WAKE_IN) ; port WAKE_IN
LAN8870_LED2: R53.2 U2.31(LED2/GPIO2/1588_REF_CLK)
LAN8870_LED3: R54.2 U2.30(LED3/S_CLKP/MAC_MODE)
LAN8870_LINK_LED: R49.2 U2.38(LED1/GPIO1)
LAN8870_MODE_STRP: J5.1 R52.1 U2.18(1588_EVT/MODE_STRP)
LAN8870_RESET_N: C35.1 R39.2 R51.2 U2.39(RESET_N) ; port RESET_N  [project net 3V3_RST_8870]
LAN8870_RXCTL: R44.2 U2.17(RXCTL/PHYAD1) ; port RX_CTL
LAN8870_RXD0: J7.1 R50.1 U2.11(RXD0/AUTO_NEG_EN) ; port RXD0
LAN8870_RXD1: J6.1 R48.1 U2.12(RXD1/AUTO_MODE_EN) ; port RXD1
LAN8870_RXD2: R47.1 U2.14(RXD2/PHYAD0) ; port RXD2
LAN8870_RXD3: R55.2 U2.15(RXD3/REFCLK_SEL) ; port RXD3
LAN8870_SPEED_SEL: J4.1 R43.1 R64.2
LAN8870_VDDA: C50.1 C51.1 C52.1 C53.1 C54.1 R60.1 R66.2 U2.37(VDDA_PVT) U2.41(VDDA) U2.45(VDDA) U2.48(VDDA)
LAN8870_X25_N: C37.1 U2.7(XTAL2) Y2.3
LAN8870_X25_P: C36.1 U2.6(XTAL1) Y2.1
TRX_CON_N: C29.2 R37.2 ; port TRX_CON_N
TRX_CON_P: C28.2 R38.2 ; port TRX_CON_P
TRX_N: L1.2 U2.42(TRXN)
TRX_P: L1.1 U2.43(TRXP)
TRX_TERM_N: C29.1 L1.3
TRX_TERM_P: C28.1 L1.4
NetC33_2: C33.2 R37.1 R38.1 R40.1
NetC38_1: C38.1 C39.1 R60.2 U2.9(VDD_REG)
NetC40_1: C40.1 C41.1 C42.1 C43.1 R61.2 U2.10(VDDCORE) U2.19(VDDCORE) U2.29(VDDCORE)
NetC44_1: C44.1 C45.1 C46.1 C47.1 R63.2 U2.5(VDDACORE) U2.44(VDDACORE) U2.46(VDDACORE)
NetC48_1: C48.1 C49.1 R65.2 U2.22(S_VP)
NetD6_1: D6.1(K) R49.1
NetD6_4: D6.4(K) R51.1
NetD7_1: D7.1(K) R53.1
NetD7_4: D7.4(K) R54.1
NetJ4_2: J4.2 R45.2
NetJ5_2: J5.2 R46.2
NetJ6_2: J6.2 R56.2
NetJ7_2: J7.2 R57.2
NetR5_2: U2.16(RXCLK) ; port RXC
NetR7_2: U2.25(TXD0/S_OUTM) ; port TXD0
NetR8_2: U2.26(TXD1/S_OUTP) ; port TXD1
NetR9_2: U2.27(TXD2/S_INM) ; port TXD2
NetR10_2: U2.28(TXD3/S_INP) ; port TXD3
NetR11_2: U2.23(TXC/S_CLKP) ; port TXC
NetR13_2: U2.24(TXCTL/S_CLKM) ; port TX_CTL
NetR42_1: R42.1 U2.8(REG_EN)
NetR58_2: R58.2 U2.2(WAKE_OUT)
NetR64_1: R64.1 U2.32(CLKOUT/SPEED_SEL)
NetR69_1: R69.1 U2.47(EXTRES)
NetR70_1: R70.1 U2.21(S_EXTRES)

Not connected (* = marked no-connect by the designer): U2 40(NC)*

### Layout directives
differential pair; differential pair class 100DIFF: TRX_CON_N, TRX_CON_P, TRX_N, TRX_P, TRX_TERM_N, TRX_TERM_P
differential pair: LAN8870_X25_N, LAN8870_X25_P
net class PWR: LAN8870_VBAT, LAN8870_VDDA, LAN8870_VDDIO, MATENET_GND, NetC38_1, NetC40_1, NetC44_1, NetC48_1

### Notes on the sheet
- SPEED
- SLAVE
- MANAGED
- AUTO_NEG
- LAN8870 PHY ADDR = 3
- (near R55) LAN8870 Straps:
  SPEED_SEL (CLKOUT): 0 - 100BASE-T1, 1 - 1000BASE-T1
  REFCLK_SEL (RXD3): 0 - 25MHz Reference Clock, 1 - 50MHz Reference Clock
  PHYAD[1:0] (RXCTL/RXD2)- PHY Address [1:0]
  AUTO_MODE_EN (RXD1): 0 - Managed, 1 - Autonomous
  AUTO_NEG_EN (RXD0): 0 - Auto-Negotiation Disabled, 1 - Auto-Negotiation Enabled
  MODE_STRP (RXER): 0 - Client, 1 - Host

### Library data of the parts
C28-C60 = CMP-001-00058-1: as C1 on sheet 1000BASET1_MEDIA_CONVERTER; Min Operating Temperature: -55°C; Mounting Technology: Surface Mount; Pins: 2; Case/Package: 0402; RoHS Compliant: Yes; Max Operating Temperature: 85°C
D6 D7 = CMP-004-00040-2: as D5 on sheet LAN8830_PINOUT; Source: rgled.SchLib; Component Type: Standard; Design Item ID: CMP-004-00034-2; Pins: 4
J4-J7 = CMP-05178-000003-1: CONN HEADER VERT 2POS 2.54MM; RoHS Compliant: Yes
L1 = CMP-08256-000023-1: CMC 80UH 70MA 2LN 3.8KOHM SMD
R37 R38 R42-R59 R62 R69 R70 = CMP-009-00002-14: Resistor; Value: 100k
R39-R41 = CMP-009-00002-14: Resistor; Value: 100k
R60 R61 R63 R65-R68 = CMP-009-00002-14: Resistor; Value: 0
R64 = CMP-009-00118-2: READ THE NAME; Pins: 2; Component Type: Standard; Design Item ID: CMP-009-00206-2; Source: 0402jump.SchLib
U2 = CMP-015-00023-4: 100/1000BASE-T1 Rgmii/sgmii Phy; Case/Package: VQFN; Pins: 48
Y2 = CMP-2000-05733-3: as Y1 on sheet LAN8830_PINOUT; Length: 3.2mm; Depth: 2.5mm; Packaging: Tape and Reel; Min Operating Temperature: -40°C; Operating Frequency: 25 MHz; Lead Free: Lead Free; Number of Pins: 4; Frequency Tolerance: 20ppm; Radiation Hardening: No; Max Operating Temperature: 85°C; Termination: SMD/SMT; Frequency Stability: 30ppm; Frequency: 25MHz; Series: ABM8G; Mount: Surface Mount; Package Quantity: 1000; Height: 0.039inch; Width: 0.098inch; Case/Package: CSMD; ESR (Equivalent Series Resistance): 60R; Load Capacitance: 18pF; Tolerance: 20ppm

## Sheet PIC18LF25K50_PINOUT.SchDoc
size B; SheetNumber: 5; SheetTotal: 5
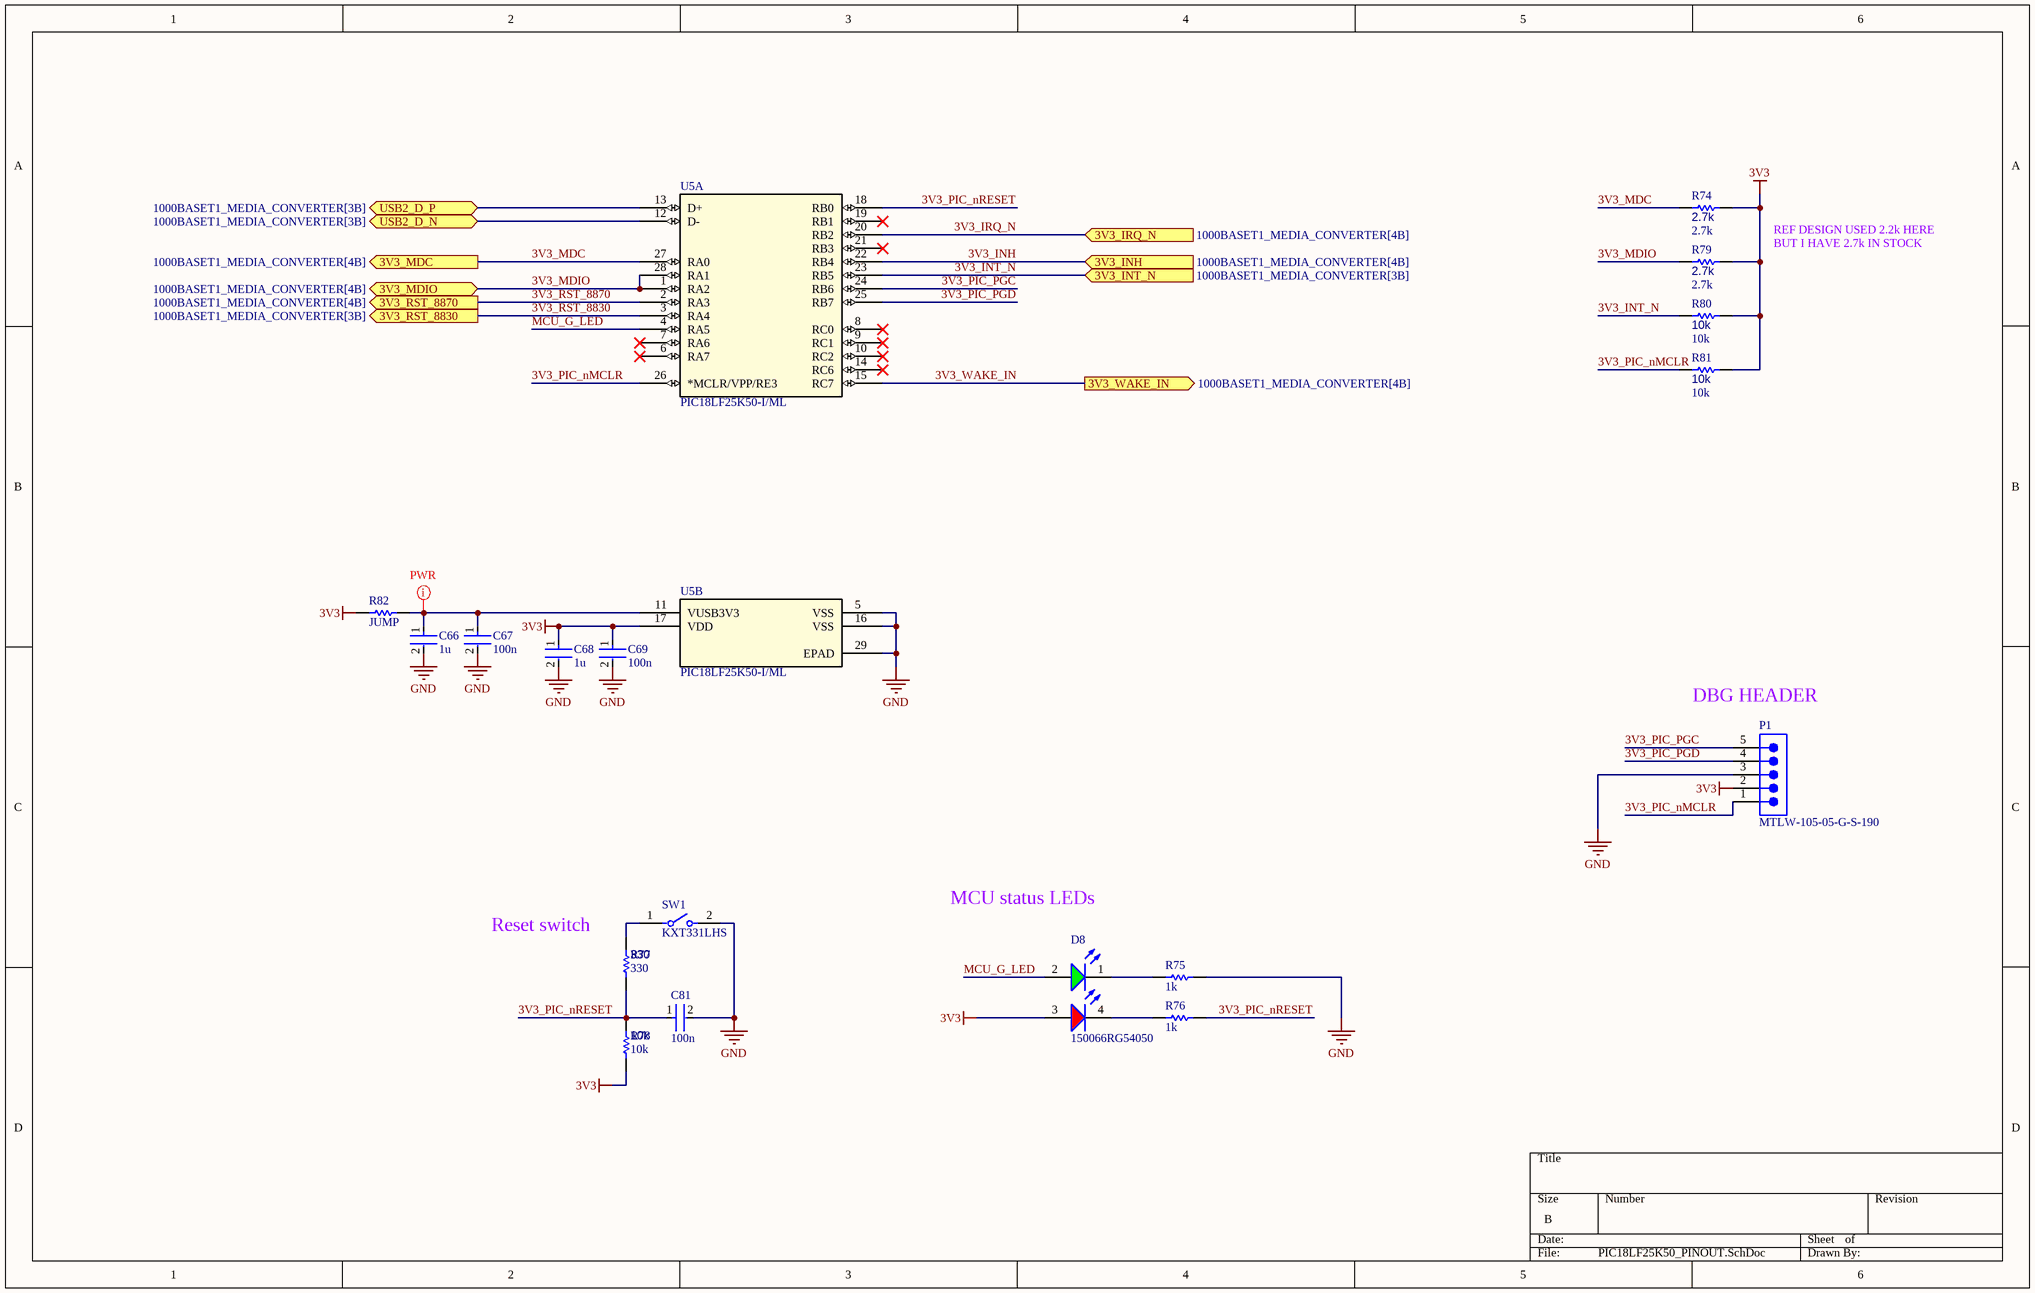
[diagram p4: PIC18LF25K50_PINOUT.SchDoc]

### Parts
C66  1u  [FP-0402-L_1_0_0_05-W_0_5-IPC_A]
C67  100n  [FP-0402-L_1_0_0_05-W_0_5-IPC_A]
C68  1u  [FP-0402-L_1_0_0_05-W_0_5-IPC_A]
C69  100n  [FP-0402-L_1_0_0_05-W_0_5-IPC_A]
C81  100n  [FP-0402-L_1_0_0_05-W_0_5-IPC_A]
D8  150066RG54050  [WL-SBCD_0606]
P1  MTLW-105-05-G-S-190  [SMTC-MTLW-105-05-X-S-190]
R74  2.7k  [R0603B]
R75  1k  [R0603B]
R76  1k  [R0603B]
R77  330  [R0603B]
R78  10k  [R0603B]
R79  2.7k  [R0603B]
R80  10k  [R0603B]
R81  10k  [R0603B]
R82  JUMP  [R0603B]
SW1  KXT331LHS  [FP-KXT331LHS-MFG]
U5  PIC18LF25K50-I/ML  [QFN65P600X600X100_HS-29N]  (parts A,B of 2)

### Ports
3V3_INH (in, see 1000BASET1_MEDIA_CONVERTER[4B]), 3V3_INT_N (in, see 1000BASET1_MEDIA_CONVERTER[3B]), 3V3_IRQ_N (in, see 1000BASET1_MEDIA_CONVERTER[4B]), 3V3_MDC (out, see 1000BASET1_MEDIA_CONVERTER[4B]), 3V3_MDIO (bidir, see 1000BASET1_MEDIA_CONVERTER[4B]), 3V3_RST_8830 (out, see 1000BASET1_MEDIA_CONVERTER[3B]), 3V3_RST_8870 (out, see 1000BASET1_MEDIA_CONVERTER[4B]), 3V3_WAKE_IN (out, see 1000BASET1_MEDIA_CONVERTER[4B]), USB2_D_N (bidir, see 1000BASET1_MEDIA_CONVERTER[3B]), USB2_D_P (bidir, see 1000BASET1_MEDIA_CONVERTER[3B])

### Nets
3V3: C68.1 C69.1 D8.3(A) P1.2 R74.1 R78.1 R79.2 R80.2 R81.2 R82.1 U5.17(VDD)
GND: C66.2 C67.2 C68.2 C69.2 C81.2 P1.3 R75.1 SW1.2 U5.5(VSS) U5.16(VSS) U5.29(EPAD)
3V3_INH: U5.22(RB4) ; port 3V3_INH
3V3_INT_N: R80.1 U5.23(RB5) ; port 3V3_INT_N
3V3_IRQ_N: U5.20(RB2) ; port 3V3_IRQ_N
3V3_MDC: R74.2 U5.27(RA0) ; port 3V3_MDC
3V3_MDIO: R79.1 U5.1(RA2) U5.28(RA1) ; port 3V3_MDIO
3V3_PIC_nMCLR: P1.1 R81.1 U5.26(*MCLR/VPP/RE3)
3V3_PIC_nRESET: C81.1 R76.1 R77.1 R78.2 U5.18(RB0)
3V3_PIC_PGC: P1.5 U5.24(RB6)
3V3_PIC_PGD: P1.4 U5.25(RB7)
3V3_RST_8830: U5.3(RA4) ; port 3V3_RST_8830
3V3_RST_8870: U5.2(RA3) ; port 3V3_RST_8870
3V3_WAKE_IN: U5.15(RC7) ; port 3V3_WAKE_IN
MCU_G_LED: D8.2(A) U5.4(RA5)
USB_MCU_N: U5.12(D-) ; port USB2_D_N
USB_MCU_P: U5.13(D+) ; port USB2_D_P
NetC66_1: C66.1 C67.1 R82.2 U5.11(VUSB3V3)
NetD8_1: D8.1(K) R75.2
NetD8_4: D8.4(K) R76.2
NetR77_2: R77.2 SW1.1

Not connected (* = marked no-connect by the designer): U5 6(RA7)* 7(RA6)* 8(RC0)* 9(RC1)* 10(RC2)* 14(RC6)* 19(RB1)* 21(RB3)*

### Layout directives
net class PWR: NetC66_1

### Notes on the sheet
- REF DESIGN USED 2.2k HERE BUT I HAVE 2.7k IN STOCK
- (near P1) DBG HEADER
- MCU status LEDs
- (near R77) Reset switch

### Library data of the parts
C66-C69 C81 = CMP-001-00058-1: as C1 on sheet 1000BASET1_MEDIA_CONVERTER; Min Operating Temperature: -55°C; Mounting Technology: Surface Mount; Pins: 2; Case/Package: 0402; RoHS Compliant: Yes; Max Operating Temperature: 85°C
  C66 C68: Value: 1u
  C67 C69 C81: Value: 100n
D8 = CMP-004-00040-2: as D5 on sheet LAN8830_PINOUT; Source: rgled.SchLib; Component Type: Standard; Design Item ID: CMP-004-00034-2; Pins: 4
P1 = CMP-1024-00076-1: Low Profile .025" SQ Post Header, Through-hole, Vertical, -55 to 125 degC, 2.54 mm Pitch, 5-Pin, Male, RoHS; Manufacturer: Samtec; Pitch: 2.54 mm; ComponentLink3Description: Package Specification; ComponentLink1Description: Manufacturer URL; ComponentLink1URL: http://www.samtec.com; PartNumber: MTLW-105-05-G-S-190; Mounting Technology: Through-hole; Orientation: Vertical; ComponentLink3URL: http://www.samtec.com/documents/webfiles/cpdf/MTLW-1XX-XX-XX-X-XXX-XX-XX-MKT1.pdf; PackageReference: MTLW-105-05-X-S-190; ComponentLink2URL: http://www.samtec.com/documents/webfiles/pdf/MTLW_TH.PDF; ComponentLink2Description: Datasheet; PackageDescription: Low Profile Terminal Assembly; Temperature Range: -55 to 125 degC; DatasheetVersion: F-214; RoHS: True; PackageVersion: T, 6/1991
R74-R81 = CMP-009-00002-14: Resistor
  R74 R79: Value: 2.7k
  R75 R76: Value: 1k
  R77: Value: 330
  R78 R80 R81: Value: 10k
R82 = CMP-009-00002-14: Resistor; Value: 0
SW1 = CMP-10040-000029-1: SWITCH TACTILE SPST-NO 0.02A 15V; Operating Force: 240gf; Switch Travel: 0.13mm; Illumination Type: Non-Illuminated; Throw Configuration: SPST; Number of Ports: 1; Current Rating: 5A; Mechanical Life: 500000Cycles; Switch Function: Off-Mom; Connector Type: USB; Actuator Type: Standard; Gender: Receptacle; Number of Contacts: 24; Contact Plating: Gold; Insulation Color: Black; Min Operating Temperature: -40°C; Packaging: Tape and Reel; Flammability Rating: UL94 V-0; Max Operating Temperature: 85°C; Termination: Solder; Mount: Surface Mount
U5 = CMP-020-00021-1: MCU 8-bit PIC18 PIC RISC 32KB Flash 2.5V/3.3V 28-Pin QFN EP Tube - Rail/Tube; Max Supply Voltage: 3.6V; RAM Size: 2kB; Interface: I2C, SPI, UART, USART, USB; Min Supply Voltage: 1.8V; Pins: 28; Case/Package: QFN; Max Operating Temperature: 85°C; Min Operating Temperature: -40°C; Mounting Technology: Surface Mount

## Sheet PWR_MGMT.SchDoc
size B; SheetNumber: 4; SheetTotal: 5
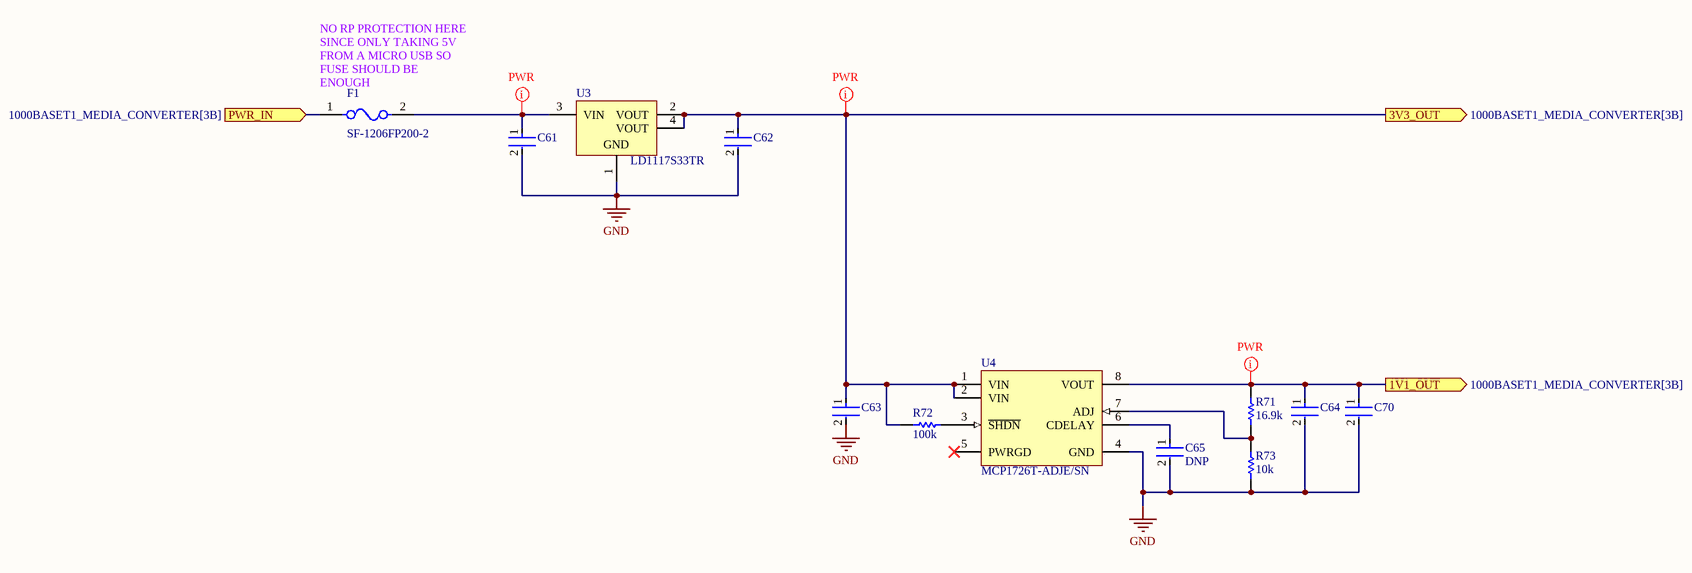
[diagram p5: PWR_MGMT.SchDoc]

### Parts
C61  C0805C475J4RACAUTO  [FP-C0805C475J4RACAUTO-MFG]  (value not drawn)
C62  GRM21BR61E226ME44L  [FP-GRM21B-0_2-e0_2_0_7-IPC_B]  (value not drawn)
C63  C0805C475J4RACAUTO  [FP-C0805C475J4RACAUTO-MFG]  (value not drawn)
C64  GRM21BR61E226ME44L  [FP-GRM21B-0_2-e0_2_0_7-IPC_B]  (value not drawn)
C65  DNP  [FP-0402-L_1_0_0_05-W_0_5-IPC_A]
C70  C0805C475J4RACAUTO  [FP-C0805C475J4RACAUTO-MFG]  (value not drawn)
F1  SF-1206FP200-2  [FP-SF-1206FP-MFG]
R71  16.9k  [R0603B]
R72  100k  [R0603B]
R73  10k  [R0603B]
U3  LD1117S33TR  [SOT-223_L]
U4  MCP1726T-ADJE/SN  [SOIC-SN8_L]

### Ports
1V1_OUT (out, see 1000BASET1_MEDIA_CONVERTER[3B]), 3V3_OUT (out, see 1000BASET1_MEDIA_CONVERTER[3B]), PWR_IN (in, see 1000BASET1_MEDIA_CONVERTER[3B])

### Nets
1V1: C64.1 C70.1 R71.2 U4.8(VOUT) ; port 1V1_OUT
3V3: C62.1 C63.1 R72.1 U3.2(VOUT) U3.4(VOUT) U4.1(VIN) U4.2(VIN) ; port 3V3_OUT
GND: C61.2 C62.2 C63.2 C64.2 C65.2 C70.2 R73.1 U3.1(GND) U4.4(GND)
NetC61_1: C61.1 F1.2 U3.3(VIN)
NetC65_1: C65.1 U4.6(CDELAY)
NetF1_1: F1.1 ; port PWR_IN
NetR71_1: R71.1 R73.2 U4.7(ADJ)
NetR72_2: R72.2 U4.3(~{SHDN})

Not connected (* = marked no-connect by the designer): U4 5(PWRGD)*

### Layout directives
net class PWR: 1V1, 3V3, NetC61_1

### Notes on the sheet
- (near F1) NO RP PROTECTION HERE SINCE ONLY TAKING 5V FROM A MICRO USB SO FUSE SHOULD BE ENOUGH

### Library data of the parts
C61 C63 C70 = CMP-00212-84766729-1: C0805C475J4RACAUTO Cap Ceramic 4.7uF 16V X7R 5% Pad SMD 0805 125C Automotive T/R; Capacitance: 4.7µF; Max Operating Temperature: 125°C; Dielectric Material: Ceramic; Voltage Rating (DC): 16V; Dielectric: X7R; Height: 1.4mm; Case/Package: 0805; NexarPartId: 84766729; Voltage Rating: 16V; RoHS: Compliant; Material: Ceramic; Packaging: Cut Tape; Tolerance: 5%; Min Operating Temperature: -55°C
C62 C64 = CMP-2007-03222-3: Chip Multilayer Ceramic Capacitors for General Purpose, 0805, 22uF, X5R, 15%, 20%, 25V; Case/Package: 0805; Depth: 1.25mm; Resistor Type: Ceramic; Voltage Rating: 25V; Lead Free: Lead Free; Voltage Rating (DC): 25V; Case Code (Metric): 2012; Thickness: 0.057inch; REACH SVHC: No SVHC; Material: Ceramic; Tolerance: 20%; Length: 2mm; Capacitance: 22uF; Case Code (Imperial): 0805; Max Operating Temperature: 85°C; Termination: SMD/SMT; Weight: 0.000335oz; Dielectric: X5R; Packaging: Tape and Reel; Voltage: 25V; Package Quantity: 3000; Height: 1.25mm; Mount: Surface Mount; Width: 1.25mm; Min Operating Temperature: -55°C
C65 = CMP-001-00058-1: as C1 on sheet 1000BASET1_MEDIA_CONVERTER; Min Operating Temperature: -55°C; Mounting Technology: Surface Mount; Pins: 2; Case/Package: 0402; RoHS Compliant: Yes; Max Operating Temperature: 85°C
F1 = CMP-07399-000013-1: FUSE BOARD MOUNT 2A 63VDC 1206; Voltage Rating (DC): 63V; Fuse Type: Board Mount (Cartridge Style Excluded); Approvals: UL; Mount: Surface Mount; Min Operating Temperature: -20°C; Max Operating Temperature: 105°C; Case Code (Imperial): 1206; Packaging: Cut Tape; Current Rating: 2A; RoHS Compliant: Yes; Series: SinglFuse™ SF-1206FP; Case Code (Metric): 3216; Case/Package: 1206
R71-R73 = CMP-009-00002-14: Resistor
  R71: Value: 16.9k
  R72: Value: 100k
  R73: Value: 10k
U3 = CMP-0244-00310-1: Fixed Low Drop Positive Voltage Regulator, 3.3V, 4-Pin SOT-223, Tape and Reel; ComponentLink2Description: Datasheet; PackageDescription: 4-Pin SOT-223 Package, 6.5 x 3.5 mm Body, 2.3 mm Pitch, 7 mm Lead Span; PackageVersion: 2010; ComponentLink2URL: http://www.st.com/internet/com/TECHNICAL_RESOURCES/TECHNICAL_LITERATURE/DATASHEET/CD00000544.pdf; PackageReference: SOT-223; DatasheetVersion: 1/11/2011; ComponentLink1Description: Manufacturer URL; ComponentLink1URL: http://www.st.com
U4 = CMP-0136-00217-1: 1A, Low Voltage, Low Quiescent Current LDO Regulator, 8-Pin SOIC 150mil, Extended Temperature, Tape and Reel; DatasheetVersion: revC, Aug-2007; PackageReference: SOIC-SN8; Code_IPC: SOIC127P600-8; PackageVersion: revBB, Aug-2009; PackageDescription: 8-Lead Plastic Small Outline (SN) - Narrow, 3.90mm Body [SOIC]; Code_JEDEC: MS-012

## Nets that join several sheets
1V1: LAN8830_PINOUT (R32.1 R33.1 R36.1), LAN8870_PINOUT (R61.1 R63.1 R65.1), PWR_MGMT (C64.1 C70.1 R71.2 U4.8)
3V3: 1000BASET1_MEDIA_CONVERTER (J1.L2 J1.L4), LAN8830_PINOUT (D5.2 D5.3 R31.1 R34.1), LAN8870_PINOUT (7 pins), PIC18LF25K50_PINOUT (11 pins), PWR_MGMT (7 pins)
GND: 1000BASET1_MEDIA_CONVERTER (47 pins), LAN8830_PINOUT (33 pins), LAN8870_PINOUT (43 pins), PIC18LF25K50_PINOUT (11 pins), PWR_MGMT (9 pins)
MATENET_GND: 1000BASET1_MEDIA_CONVERTER (J2.3), LAN8870_PINOUT (6 pins)
3V3_INH: LAN8870_PINOUT (R41.1 U2.4), PIC18LF25K50_PINOUT (U5.22)
3V3_INT_N: LAN8830_PINOUT (R18.1), PIC18LF25K50_PINOUT (R80.1 U5.23)
3V3_IRQ_N: LAN8870_PINOUT (U2.35), PIC18LF25K50_PINOUT (U5.20)
3V3_MDC: LAN8830_PINOUT (U1.37), LAN8870_PINOUT (U2.34), PIC18LF25K50_PINOUT (R74.2 U5.27)
3V3_MDIO: LAN8830_PINOUT (U1.38), LAN8870_PINOUT (U2.33), PIC18LF25K50_PINOUT (R79.1 U5.1 U5.28)
3V3_RST_8830: LAN8830_PINOUT (C6.1 R17.2 R28.2 U1.43), PIC18LF25K50_PINOUT (U5.3)
3V3_RST_8870: LAN8870_PINOUT (C35.1 R39.2 R51.2 U2.39), PIC18LF25K50_PINOUT (U5.2)
3V3_WAKE_IN: LAN8870_PINOUT (R59.2 R62.1 U2.3), PIC18LF25K50_PINOUT (U5.15)
LAN8830_CLK125_EN: 1000BASET1_MEDIA_CONVERTER (R13.1), LAN8830_PINOUT (R30.2 U1.34)
LAN8830_MODE0: 1000BASET1_MEDIA_CONVERTER (R7.1), LAN8830_PINOUT (R22.2 U1.33)
LAN8830_MODE1: 1000BASET1_MEDIA_CONVERTER (R8.1), LAN8830_PINOUT (R23.2 U1.32)
LAN8830_MODE2: 1000BASET1_MEDIA_CONVERTER (R9.1), LAN8830_PINOUT (R24.2 U1.30)
LAN8830_MODE3: 1000BASET1_MEDIA_CONVERTER (R10.1), LAN8830_PINOUT (R25.2 U1.29)
LAN8830_MODE4: 1000BASET1_MEDIA_CONVERTER (R11.1), LAN8830_PINOUT (R21.2 U1.36)
LAN8830_PHYAD0: 1000BASET1_MEDIA_CONVERTER (R14.1), LAN8830_PINOUT (R27.2 U1.18)
LAN8830_PHYAD1: 1000BASET1_MEDIA_CONVERTER (R12.1), LAN8830_PINOUT (R20.2 R26.2 U1.16)
LAN8830_TXRXA_N: 1000BASET1_MEDIA_CONVERTER (D2.2 D2.9 J1.P3), LAN8830_PINOUT (U1.3)
LAN8830_TXRXA_P: 1000BASET1_MEDIA_CONVERTER (D2.1 D2.10 J1.P2), LAN8830_PINOUT (U1.2)
LAN8830_TXRXB_N: 1000BASET1_MEDIA_CONVERTER (D2.5 D2.6 J1.P5), LAN8830_PINOUT (U1.6)
LAN8830_TXRXB_P: 1000BASET1_MEDIA_CONVERTER (D2.4 D2.7 J1.P4), LAN8830_PINOUT (U1.5)
LAN8830_TXRXC_N: 1000BASET1_MEDIA_CONVERTER (D3.2 D3.9 J1.P8), LAN8830_PINOUT (U1.8)
LAN8830_TXRXC_P: 1000BASET1_MEDIA_CONVERTER (D3.1 D3.10 J1.P7), LAN8830_PINOUT (U1.7)
LAN8830_TXRXD_N: 1000BASET1_MEDIA_CONVERTER (D3.5 D3.6 J1.P10), LAN8830_PINOUT (U1.11)
LAN8830_TXRXD_P: 1000BASET1_MEDIA_CONVERTER (D3.4 D3.7 J1.P9), LAN8830_PINOUT (U1.10)
LAN8870_RXCTL: 1000BASET1_MEDIA_CONVERTER (R6.2), LAN8870_PINOUT (R44.2 U2.17)
LAN8870_RXD0: 1000BASET1_MEDIA_CONVERTER (R1.2), LAN8870_PINOUT (J7.1 R50.1 U2.11)
LAN8870_RXD1: 1000BASET1_MEDIA_CONVERTER (R2.2), LAN8870_PINOUT (J6.1 R48.1 U2.12)
LAN8870_RXD2: 1000BASET1_MEDIA_CONVERTER (R3.2), LAN8870_PINOUT (R47.1 U2.14)
LAN8870_RXD3: 1000BASET1_MEDIA_CONVERTER (R4.2), LAN8870_PINOUT (R55.2 U2.15)
NetF1_1: 1000BASET1_MEDIA_CONVERTER (J3.1), PWR_MGMT (F1.1)
NetR1_1: 1000BASET1_MEDIA_CONVERTER (R1.1), LAN8830_PINOUT (U1.19)
NetR2_1: 1000BASET1_MEDIA_CONVERTER (R2.1), LAN8830_PINOUT (U1.20)
NetR3_1: 1000BASET1_MEDIA_CONVERTER (R3.1), LAN8830_PINOUT (U1.21)
NetR4_1: 1000BASET1_MEDIA_CONVERTER (R4.1), LAN8830_PINOUT (U1.22)
NetR5_1: 1000BASET1_MEDIA_CONVERTER (R5.1), LAN8830_PINOUT (U1.25)
NetR5_2: 1000BASET1_MEDIA_CONVERTER (R5.2), LAN8870_PINOUT (U2.16)
NetR6_1: 1000BASET1_MEDIA_CONVERTER (R6.1), LAN8830_PINOUT (U1.26)
NetR7_2: 1000BASET1_MEDIA_CONVERTER (R7.2), LAN8870_PINOUT (U2.25)
NetR8_2: 1000BASET1_MEDIA_CONVERTER (R8.2), LAN8870_PINOUT (U2.26)
NetR9_2: 1000BASET1_MEDIA_CONVERTER (R9.2), LAN8870_PINOUT (U2.27)
NetR10_2: 1000BASET1_MEDIA_CONVERTER (R10.2), LAN8870_PINOUT (U2.28)
NetR11_2: 1000BASET1_MEDIA_CONVERTER (R11.2), LAN8870_PINOUT (U2.23)
NetR13_2: 1000BASET1_MEDIA_CONVERTER (R13.2), LAN8870_PINOUT (U2.24)
TRX_CON_N: 1000BASET1_MEDIA_CONVERTER (D4.4 D4.7 J2.2), LAN8870_PINOUT (C29.2 R37.2)
TRX_CON_P: 1000BASET1_MEDIA_CONVERTER (D4.2 D4.9 J2.1), LAN8870_PINOUT (C28.2 R38.2)
USB_MCU_N: 1000BASET1_MEDIA_CONVERTER (R15.2), PIC18LF25K50_PINOUT (U5.12)
USB_MCU_P: 1000BASET1_MEDIA_CONVERTER (R16.2), PIC18LF25K50_PINOUT (U5.13)